# Altium project display.PrjPcb (part 1 of 2)
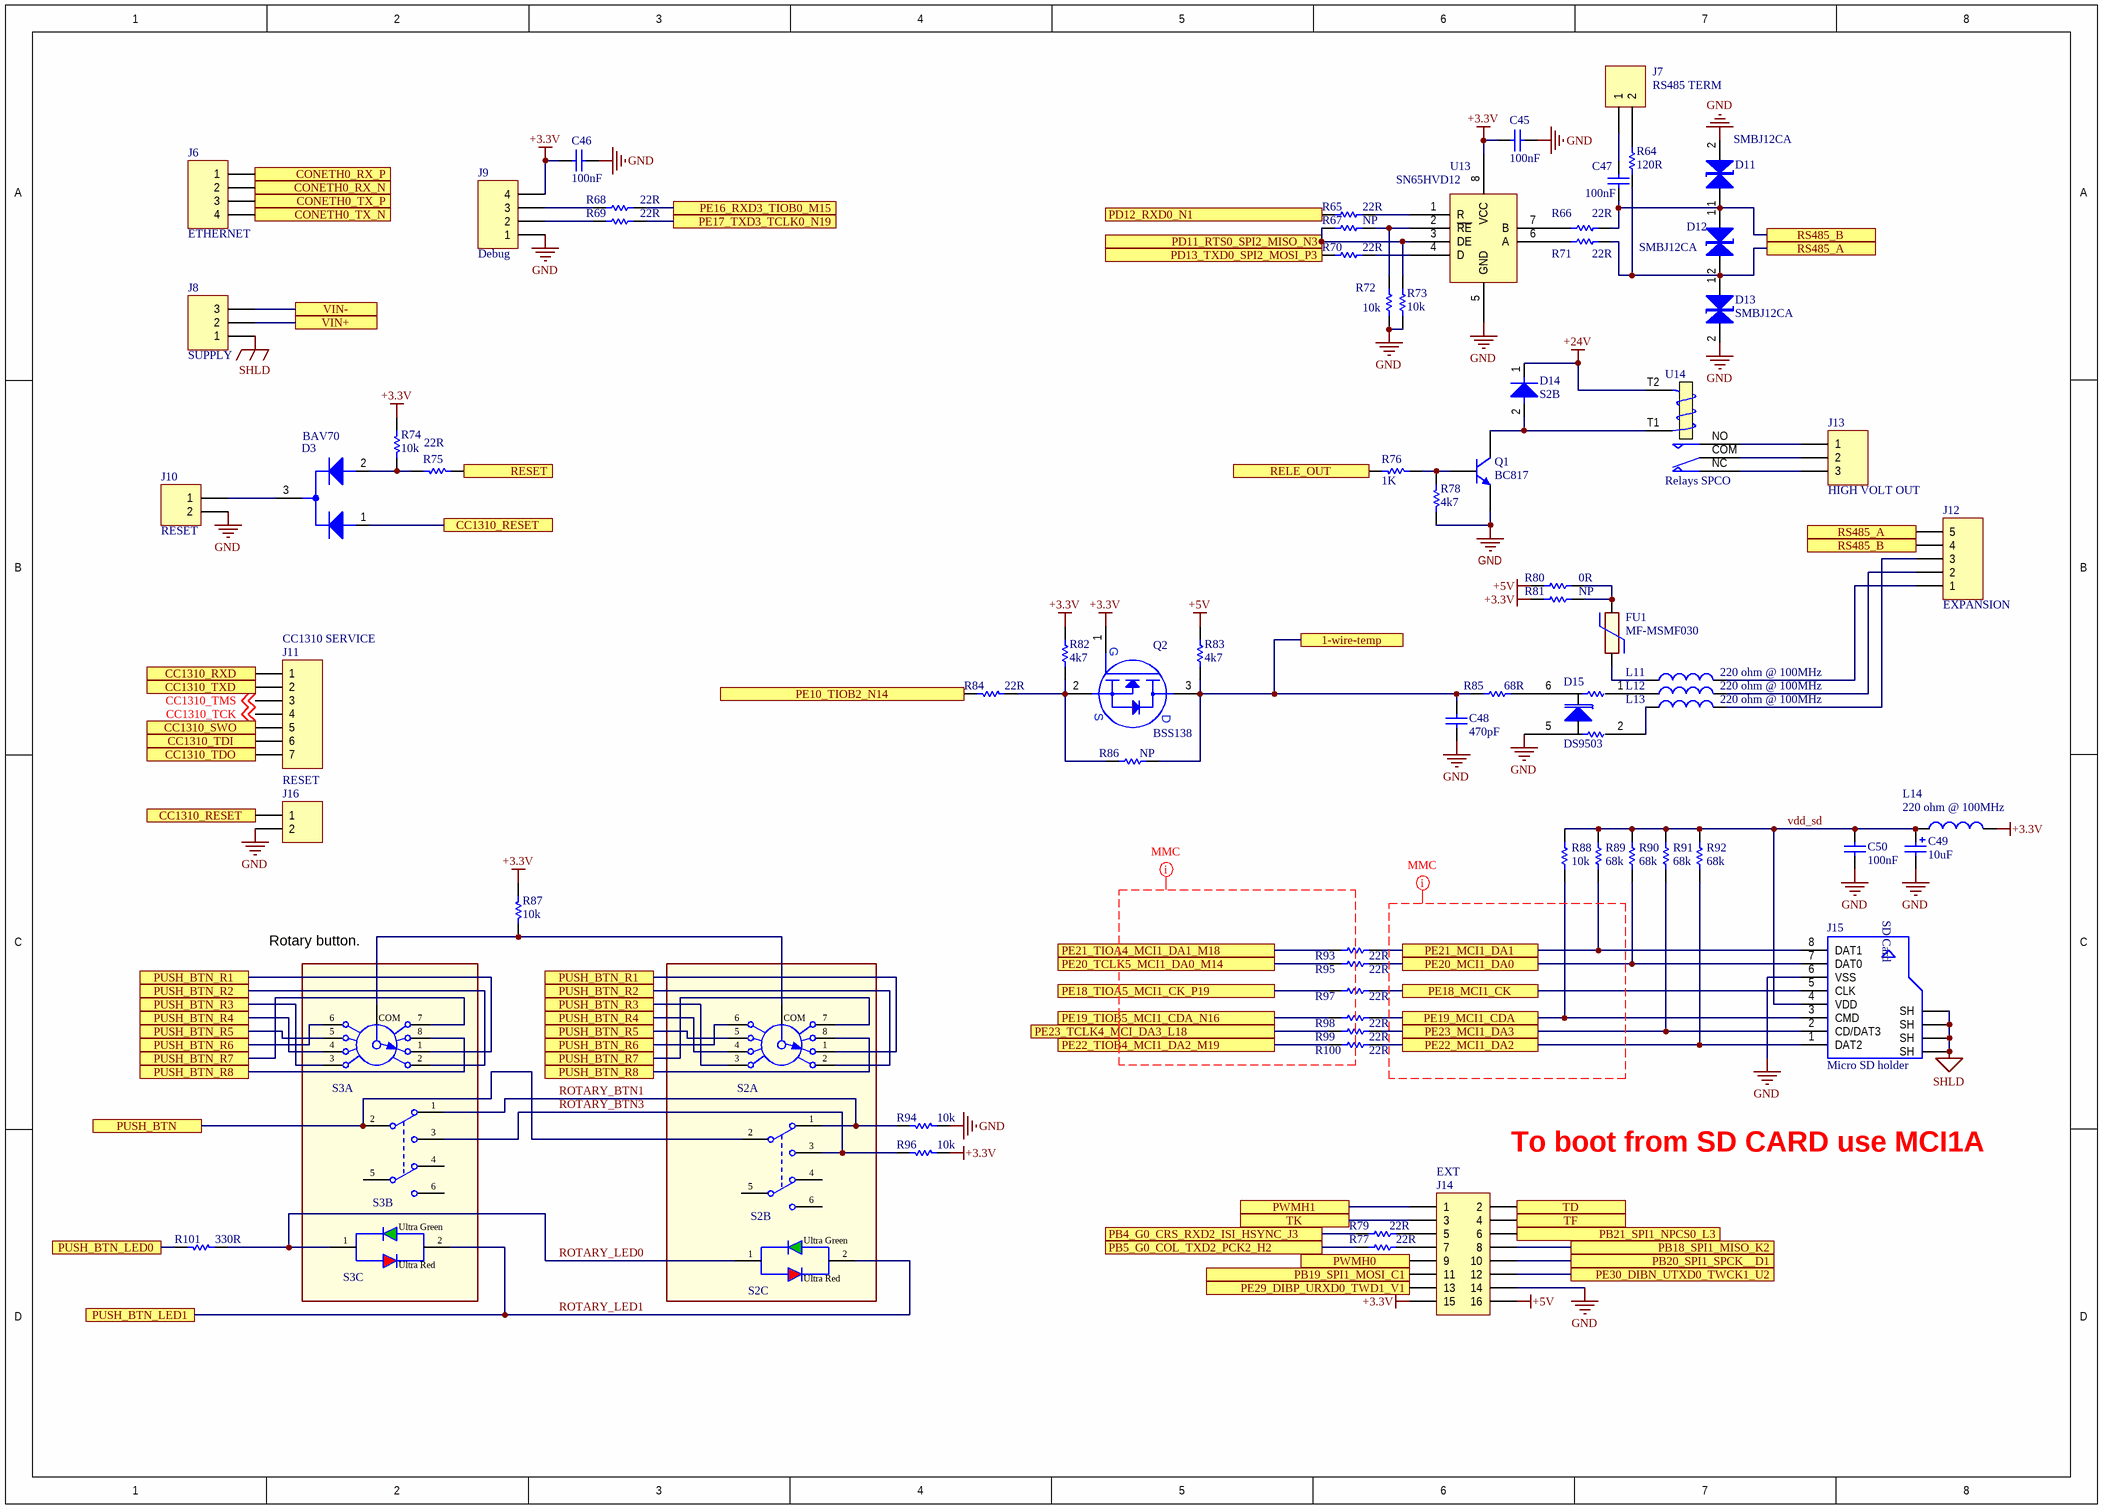
[diagram p0: connector.SchDoc]
8 sheets, 343 parts. Net scope: flat (ports and power ports of the same name join across sheets).
Board file: display.PcbDoc
Sheets:
  connector.SchDoc
  develboard.SchDoc
  display.SchDoc
  supply.SchDoc
  sensor_output.SchDoc
  wifi.schdoc
  ethernet.SchDoc
  sub-1Ghz_radio.SchDoc

## Sheet connector.SchDoc: Connectors
size A3; Hw_rev: 0; License: GPLv3; Address3: Firenze; Address4: ITALY; DocumentNumber: 1; Revision: 0; SheetNumber: 1; SheetTotal: 8

### Parts
C45  100nF  [0603_[1608]]
C46  100nF  [0603_[1608]]
C47  100nF  [0603_[1608]]
C48  470pF  [0603_[1608]]
C49  10uF  [1206_[3216]]
C50  100nF  [0603_[1608]]
D3  BAV70  [SOT-23]
D11  SMBJ12CA  [DO214AA_K1-A2_SMB]
D12  SMBJ12CA  [DO214AA_K1-A2_SMB]
D13  SMBJ12CA  [DO214AA_K1-A2_SMB]
D14  S2B  [DO214AA_K1-A2_SMB]
D15  DS9503  [TSOC6]
FU1  MF-MSMF030  [1812-[4532]]
J6  ETHERNET  [CON_4P_WAGO_2.5MM]
J7  RS485 TERM  [HEADER_1X2_2.54MM_THD]
J8  SUPPLY  [CON_3P_WAGO_3.5mm]
J9  Debug  [HEADER_1X4_2.54MM_THD]
J10  RESET  [HEADER_1X2_2.54MM_THD]
J11  CC1310 SERVICE  [HEADER_1X7_2.54MM_THD]
J12  EXPANSION  [CON_5P_WAGO_2.5MM]
J13  HIGH VOLT OUT  [CON_3P_WAGO_3.5mm]
J14  EXT  [HEADER_2X8_2.54MM_THD]
J15  Micro SD holder  [micro_sd_holder_pp]
J16  RESET  [HEADER_1X2_2.54MM_THD]
L11  220 ohm @ 100MHz  [0805_[2012]]
L12  220 ohm @ 100MHz  [0805_[2012]]
L13  220 ohm @ 100MHz  [0805_[2012]]
L14  220 ohm @ 100MHz  [0805_[2012]]
Q1  BC817  [SOT-23]
Q2  BSS138  [sot-23]
R64  120R  [0603_[1608]]
R65  22R  [0603_[1608]]
R66  22R  [0603_[1608]]
R67  NP  [0603_[1608]]
R68  22R  [0603_[1608]]
R69  22R  [0603_[1608]]
R70  22R  [0603_[1608]]
R71  22R  [0603_[1608]]
R72  10k  [0603_[1608]]
R73  10k  [0603_[1608]]
R74  10k  [0603_[1608]]
R75  22R  [0603_[1608]]
R76  1K  [0603_[1608]]
R77  22R  [0603_[1608]]
R78  4k7  [0603_[1608]]
R79  22R  [0603_[1608]]
R80  0R  [0603_[1608]]
R81  NP  [0603_[1608]]
R82  4k7  [0603_[1608]]
R83  4k7  [0603_[1608]]
R84  22R  [0603_[1608]]
R85  68R  [0603_[1608]]
R86  NP  [0603_[1608]]
R87  10k  [0603_[1608]]
R88  10k  [0603_[1608]]
R89  68k  [0603_[1608]]
R90  68k  [0603_[1608]]
R91  68k  [0603_[1608]]
R92  68k  [0603_[1608]]
R93  22R  [0603_[1608]]
R94  10k  [0603_[1608]]
R95  22R  [0603_[1608]]
R96  10k  [0603_[1608]]
R97  22R  [0603_[1608]]
R98  22R  [0603_[1608]]
R99  22R  [0603_[1608]]
R100  22R  [0603_[1608]]
R101  330R  [0603_[1608]]
S2  481RV12172100  [Rotary-push-button-481RV12172100]  (value not drawn)  (parts A,B,C of 3)
S3  481RV12172100  [Rotary-push-button-481RV12172100]  (value not drawn)  (parts A,B,C of 3)
U13  SN65HVD12  [SOIC8]
U14  Relays SPCO  [RELAYS_SPDT_THD_20x10MM]

### Ports
1-wire-temp, CC1310_RESET, CC1310_RXD, CC1310_SWO, CC1310_TDI, CC1310_TDO, CC1310_TXD, CONETH0_RX_N, CONETH0_RX_P, CONETH0_TX_N, CONETH0_TX_P, PB4_G0_CRS_RXD2_ISI_HSYNC_J3, PB5_G0_COL_TXD2_PCK2_H2, PB18_SPI1_MISO_K2, PB19_SPI1_MOSI_C1, PB20_SPI1_SPCK__D1, PB21_SPI1_NPCS0_L3, PD11_RTS0_SPI2_MISO_N3, PD12_RXD0_N1, PD13_TXD0_SPI2_MOSI_P3, PE10_TIOB2_N14, PE16_RXD3_TIOB0_M15, PE17_TXD3_TCLK0_N19, PE18_MCI1_CK, PE18_TIOA5_MCI1_CK_P19, PE19_MCI1_CDA, PE19_TIOB5_MCI1_CDA_N16, PE20_MCI1_DA0, PE20_TCLK5_MCI1_DA0_M14, PE21_MCI1_DA1, PE21_TIOA4_MCI1_DA1_M18, PE22_MCI1_DA2, PE22_TIOB4_MCI1_DA2_M19, PE23_MCI1_DA3, PE23_TCLK4_MCI_DA3_L18, PE29_DIBP_URXD0_TWD1_V1, PE30_DIBN_UTXD0_TWCK1_U2, PUSH_BTN, PUSH_BTN_LED0, PUSH_BTN_LED1, PUSH_BTN_R1, PUSH_BTN_R2, PUSH_BTN_R3, PUSH_BTN_R4, PUSH_BTN_R5, PUSH_BTN_R6, PUSH_BTN_R7, PUSH_BTN_R8, PWMH0, PWMH1, RELE_OUT, RESET, RS485_A, RS485_B, TD, TF, TK, VIN+, VIN-

### Nets
+3.3V: C45.2 C46.1 J9.4 J14.15 L14.1 Q2.1(G) R74.1 R81.2 R82.2 R87.1 R96.1 U13.8(VCC)
+5V: J14.16 R80.2 R83.2
+24V: D14.1(K) U14.T2
GND: C45.1 C46.2 C48.2 C49.2 C50.2 D11.2 D13.2 D15.5 J9.1 J10.2 J14.14 J15.6(VSS) J16.2 Q1.2(E) R72.1 R73.1 R78.1 R94.1 U13.5(GND)
SHLD: J8.1 J15.Z1(SH) J15.Z2(SH) J15.Z3(SH) J15.Z4(SH)
1-wire-temp: C48.1 Q2.3(D) R83.1 R85.1 R86.2 ; port 1-wire-temp
CC1310_RESET: D3.1 J16.1 ; port CC1310_RESET
CC1310_RXD: J11.1 R77.1 ; port PB5_G0_COL_TXD2_PCK2_H2, port CC1310_RXD
CC1310_SWO: J11.5 ; port CC1310_SWO
CC1310_TCK: J11.4 ; off-sheet CC1310_TCK
CC1310_TDI: J11.6 ; port CC1310_TDI
CC1310_TDO: J11.7 ; port CC1310_TDO
CC1310_TMS: J11.3 ; off-sheet CC1310_TMS
CC1310_TXD: J11.2 R79.1 ; port PB4_G0_CRS_RXD2_ISI_HSYNC_J3, port CC1310_TXD
crx_n: J6.2 ; port CONETH0_RX_N
crx_p: J6.1 ; port CONETH0_RX_P
ctx_n: J6.4 ; port CONETH0_TX_N
ctx_p: J6.3 ; port CONETH0_TX_P
PB15_G0_TX3_SPI2_NPCS2_PWML0_E2: R76.2 ; port RELE_OUT
PB18_SPI1_MISO_K2: J14.8 ; port PB18_SPI1_MISO_K2
PB19_SPI1_MOSI_C1: J14.11 ; port PB19_SPI1_MOSI_C1
PB20_SPI1_SPCK__D1: J14.10 ; port PB20_SPI1_SPCK__D1
PB21_SPI1_NPCS0_L3: J14.6 ; port PB21_SPI1_NPCS0_L3
PC20_ISI_D1_TF1_V11: S2.R4 S3.R4 ; port PUSH_BTN_R4
PC23_ISI_D4_RD1_U16: R101.2 ; port PUSH_BTN_LED0
PC31_AD4_PWMH1_T13: S2.P2 S3.P2 ; port PUSH_BTN
PD11_RTS0_SPI2_MISO_N3: R67.2 R73.2 U13.3(DE) ; port PD11_RTS0_SPI2_MISO_N3
PD12_RXD0_N1: R65.2 ; port PD12_RXD0_N1
PD13_TXD0_SPI2_MOSI_P3: R70.2 ; port PD13_TXD0_SPI2_MOSI_P3
PD19_P11: S2.R8 S3.R8 ; port PUSH_BTN_R8
PD21_P10: S2.R2 S3.R2 ; port PUSH_BTN_R2
PD22_U11: S2.R5 S3.R5 ; port PUSH_BTN_R5
PD23_R10: S2.R1 S3.R1 ; port PUSH_BTN_R1
PD24_U10: S2.R7 S3.R7 ; port PUSH_BTN_R7
PD25_R11: S2.R6 S3.R6 ; port PUSH_BTN_R6
PD31_SPI0_NPCS2_PCK1_P5: S2.R3 S3.R3 ; port PUSH_BTN_R3
PE10_TIOB2_N14: R84.2 ; port PE10_TIOB2_N14
PE16_RXD3_TIOB0_M15: R68.1 ; port PE16_RXD3_TIOB0_M15
PE17_TXD3_TCLK0_N19: R69.1 ; port PE17_TXD3_TCLK0_N19
PE18_MCI1_CK: J15.5(CLK) R97.2 ; port PE18_MCI1_CK
PE18_TIOA5_MCI1_CK_P19: R97.1 ; port PE18_TIOA5_MCI1_CK_P19
PE19_MCI1_CDA: J15.3(CMD) R88.2 R98.2 ; port PE19_MCI1_CDA
PE19_TIOB5_MCI1_CDA_N16: R98.1 ; port PE19_TIOB5_MCI1_CDA_N16
PE20_MCI1_DA0: J15.7(DAT0) R90.2 R95.2 ; port PE20_MCI1_DA0
PE20_TCLK5_MCI1_DA0_M14: R95.1 ; port PE20_TCLK5_MCI1_DA0_M14
PE21_MCI1_DA1: J15.8(DAT1) R89.2 R93.2 ; port PE21_MCI1_DA1
PE21_TIOA4_MCI1_DA1_M18: R93.1 ; port PE21_TIOA4_MCI1_DA1_M18
PE22_MCI1_DA2: J15.1(DAT2) R92.2 R100.2 ; port PE22_MCI1_DA2
PE22_TIOB4_MCI1_DA2_M19: R100.1 ; port PE22_TIOB4_MCI1_DA2_M19
PE23_MCI1_DA3: J15.2(CD/DAT3) R91.2 R99.2 ; port PE23_MCI1_DA3
PE23_TCLK4_MCI_DA3_L18: R99.1 ; port PE23_TCLK4_MCI_DA3_L18
PE29_DIBP_URXD0_TWD1_V1: J14.13 ; port PE29_DIBP_URXD0_TWD1_V1
PE30_DIBN_UTXD0_TWCK1_U2: J14.12 ; port PE30_DIBN_UTXD0_TWCK1_U2
PWMH0: J14.9 ; port PWMH0
PWMH1: J14.1 ; port PWMH1
RESET: R75.2 ; port RESET
ROTARY_BTN1: R94.2 S2.P1 S3.P1
ROTARY_BTN3: R96.2 S2.P3 S3.P3
ROTARY_LED0: R101.1 S2.L1 S3.L1
ROTARY_LED1: S2.L2 S3.L2 ; port PUSH_BTN_LED1
RS485_A: D12.2 D13.1 J12.5 R64.2 R71.2 ; port RS485_A
RS485_B: C47.2 D11.1 D12.1 J12.4 R66.2 ; port RS485_B
TD: J14.2 ; port TD
TF: J14.4 ; port TF
TK: J14.3 ; port TK
vdd_sd: C49.1 C50.1 J15.4(VDD) L14.2 R88.1 R89.1 R90.1 R91.1 R92.1
VIN+: J8.2 ; port VIN+
VIN-: J8.3 ; port VIN-
NetC47_1: C47.1 J7.1
NetD3_2: D3.2 R74.2 R75.1
NetD3_3: D3.3 J10.1
NetD14_2: D14.2(A) Q1.3(C) U14.T1
NetD15_1: D15.1 L12.1
NetD15_2: D15.2 L13.1
NetD15_6: D15.6 R85.2
NetFU1_1: FU1.1 R80.1 R81.1
NetFU1_2: FU1.2 L11.1
NetJ7_2: J7.2 R64.1
NetJ9_2: J9.2 R69.2
NetJ9_3: J9.3 R68.2
NetJ12_1: J12.1 L11.2
NetJ12_2: J12.2 L12.2
NetJ12_3: J12.3 L13.2
NetJ13_1: J13.1 U14.NO
NetJ13_2: J13.2 U14.COM
NetJ13_3: J13.3 U14.NC
NetJ14_5: J14.5 R79.2
NetJ14_7: J14.7 R77.2
NetQ1_1: Q1.1(B) R76.1 R78.2
NetQ2_2: Q2.2(S) R82.1 R84.1 R86.1
NetR65_1: R65.1 U13.1(R)
NetR66_1: R66.1 U13.7(B)
NetR67_1: R67.1 R72.2 U13.2(~{RE})
NetR70_1: R70.1 U13.4(D)
NetR71_1: R71.1 U13.6(A)
NetR87_2: R87.2 S2.C S3.C

Not connected (* = marked no-connect by the designer): S2 P4 P5 P6; S3 P4 P5 P6

### Layout directives
net class mmc: (no net found under the mark)
net class mmc_con: (no net found under the mark)

### Notes on the sheet
- Rotary button.
- To boot from SD CARD use MCI1A
- (in symbol micro_sd_holde) SD Card
- (in symbol Rotary-push-button-481RV12172100, part A) 6; COM; 7; 5; 8; 4; 1; 3; 2
- (in symbol Rotary-push-button-481RV12172100, part B) 1; 2; 3; 4; 5; 6
- (in symbol Rotary-push-button-481RV12172100, part C) Ultra Green; 1; 2; Ultra Red

### Library data of the parts
C45 C47 C48 C50 = Cap: Ceramic X7R 50V; Value: 100pF; Published: 8-Jun-2000; LatestRevisionDate: 17-Jul-2002; LatestRevisionNote: Re-released for DXP Platform.; PackageReference: RAD-0.3; Publisher: Altium Limited; PackageDescription: Radial Cap, Thru-Hole; 2 Leads; 0.3 in Pin Spacing
C46 = Cap: Ceramic X7R 50V; Value: 10nF; Published: 8-Jun-2000; Revision: July-2002: Re-released for DXP Platform.; Publisher: Altium Limited
C49 = Cap Pol1: Ceramic X5R 25V; Published: 8-Jun-2000; Revision: July-2002: Re-released for DXP Platform.; Publisher: Altium Limited; Value: 10uF
D3 = BAV70: SOT23
D11-D13 = TVS bi: TVS bidirectional
D14 = Diode: S2B Diode
D15 = DS9503: ESD Protection Diode with Resistors; Mouser: 700-DS9503P+T&R; Farnell: 2516827
FU1 = FuseAutoReset: Fuse autoreset; Farnell: 1652168; Mouser: 652-MF-MSMF030-2
J6 = Header 4: Header, 4-Pin; LatestRevisionDate: 17-Jul-2002; LatestRevisionNote: Re-released for DXP Platform.; Publisher: Altium Limited
J7 = Header 2: Pin Header, 2.54mm, 1x2, 2pin; LatestRevisionDate: 17-Jul-2002; LatestRevisionNote: Re-released for DXP Platform.; Publisher: Altium Limited
J8 J13 = Header 3: Terminal Block, 3.5mm, 3p, screew less; LatestRevisionDate: 17-Jul-2002; LatestRevisionNote: Re-released for DXP Platform.; Publisher: Altium Limited
J9 = Header 4: Pin Header, 4pin, 4x1, 2.54mm, THD; LatestRevisionDate: 17-Jul-2002; LatestRevisionNote: Re-released for DXP Platform.; Publisher: Altium Limited
J10 J16 = Header 2: Pin Header, 2pin, 1x2, 2.54mm, THD; LatestRevisionDate: 17-Jul-2002; LatestRevisionNote: Re-released for DXP Platform.; Publisher: Altium Limited
J11 = Header 7: Header, 7-Pin; LatestRevisionDate: 17-Jul-2002; LatestRevisionNote: Re-released for DXP Platform.; Publisher: Altium Limited
J12 = Header 5: Terminal Block, 2.5mm, 5p (Wago 250-405); LatestRevisionDate: 17-Jul-2002; LatestRevisionNote: Re-released for DXP Platform.; Publisher: Altium Limited
J14 = Header 8X2: Header, 8-Pin, Dual row; LatestRevisionDate: 17-Jul-2002; LatestRevisionNote: Re-released for DXP Platform.; Publisher: Altium Limited
J15 = micro_sd_holde: WR-CRD Micro SD_Push and Push (693071010811); Manufacturer: Würth Elektronik eiSos GmbH; ComponentLink1 Description: Manufacturer; ComponentLink2 Description: Datasheet; NoPins: 8; ComponentLink1URL: http://www.we-online.de; ComponentLink2URL: http://katalog.we-online.de/em/datasheet/693071010811.pdf; Created by: Karrer Zheng; Created Date: 10/10/2014; partNo: 693071010811
L11-L13 = Inductor: WE 742792022; Code_IEC: 1005; Value: 10mH; Published: 8-Jun-2000; LatestRevisionDate: 29-May-2009; LatestRevisionNote: IPC-7351 Footprint Added.; PackageReference: 0402-A; Publisher: Altium Limited; PackageDescription: Chip Inductor; Code_JEITA: 0402
L14 = Inductor: WE 742792022
Q1 = BC817: NPN General-purpose Transistor; Published: 17-Sep-2003; LatestRevisionDate: 12-Dec-2006; LatestRevisionNote: IPC-7351 Footprint Added.; DatasheetVersion: Jun-1999; PackageVersion: May-1999; PackageReference: SOT23; Publisher: Altium Limited; PackageDescription: 3-Pin SOT-23 Package 0.95 mm Pitch, 2.3 mm Lead Span; ComponentLink1Description: Manufacturer Link; ComponentLink1URL: http://www.semiconductors.philips.com/; ComponentLink2Description: Datasheet; ComponentLink2URL: http://www.semiconductors.philips.com/acrobat/datasheets/BC817_BC817W_BC337_5.pdf
Q2 = MOSFET-N 3pin: N MOS
R64 R66 R67 R71-R73 R76-R79 R82-R87 R94 R96 R101 = Res1: Resistor; Revision: July-2002: Re-released for DXP Platform.
R65 R68-R70 R74 R75 R80 R81 R88-R93 R95 R97-R100 = Res1: Resistor; Value: 1K; Published: 8-Jun-2000; Revision: July-2002: Re-released for DXP Platform.; Publisher: Altium Limited
S2 S3 = Rotary-push-button-481RV12172100: WS-RPTL 20x20 mm illuminated THT Rotary Push button Switch; Emitting Color: Red & Bright green; ComponentLink1Description: Manufacturer; ComponentLink1URL: http://www.we-online.de; ComponentLink2Description: Datasheet; ComponentLink2URL: http://katalog.we-online.de/em/datasheet/481RV12172100.pdf; Part Number: 481RV12172100; Published Date: June 2017; Publisher: Wurth Elektronik
U13 = SN65HVD12: 3.3V to RS485 interface
U14 = Relay SPCO: Relays SPCO, Coil 12V, 250Vac (Omron G5SB); Farnell: 2213814

## Sheet develboard.SchDoc
size A3; License: GPLv3; Hw_rev: 0; Address3: Firenze; Address4: ITALY; DocumentNumber: 3; Revision: 0; SheetNumber: 3; SheetTotal: 8
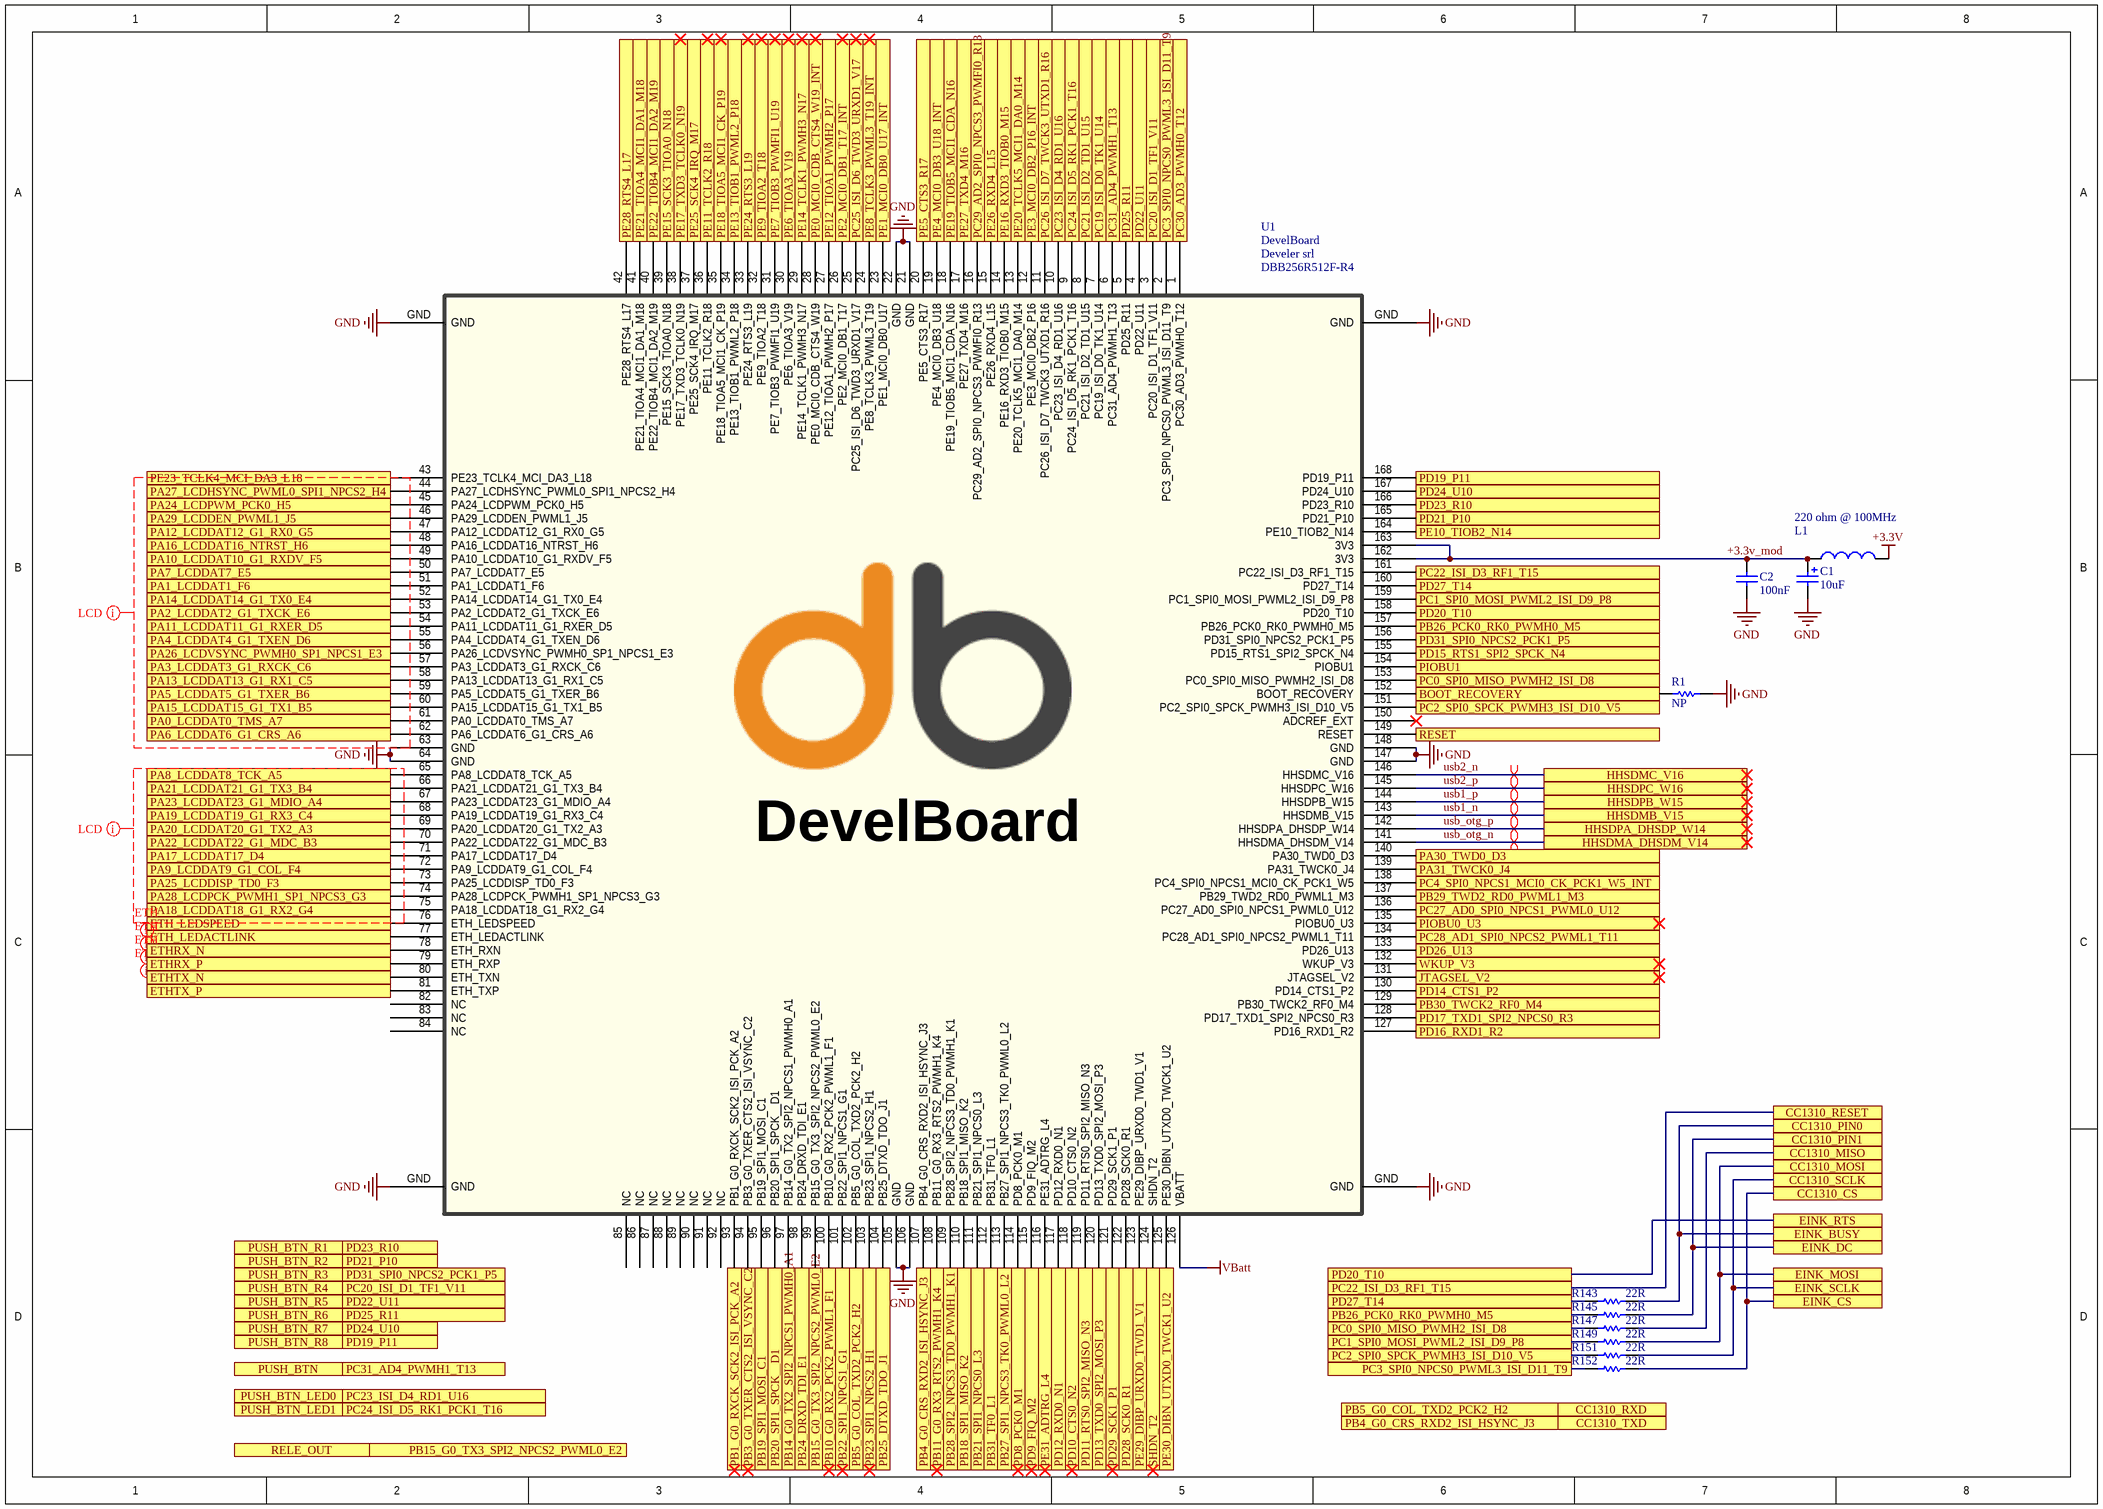
[diagram p1: develboard.SchDoc]

### Parts
C1  10uF  [1206_[3216]]
C2  100nF  [0603_[1608]]
L1  220 ohm @ 100MHz  [0805_[2012]]
R1  NP  [0603_[1608]]
R143  22R  [0603_[1608]]
R145  22R  [0603_[1608]]
R147  22R  [0603_[1608]]
R149  22R  [0603_[1608]]
R151  22R  [0603_[1608]]
R152  22R  [0603_[1608]]
U1  DevelBoard  Company: Develer srl  Order Code: DBB256R512F-R4  [develboard_footprint]

### Ports
BOOT_RECOVERY, CC1310_CS, CC1310_MISO, CC1310_MOSI, CC1310_PIN0, CC1310_PIN1, CC1310_RESET, CC1310_RXD, CC1310_SCLK, CC1310_TXD, EINK_BUSY, EINK_CS, EINK_DC, EINK_MOSI, EINK_RTS, EINK_SCLK, ETH_LEDACTLINK, ETH_LEDSPEED, ETHRX_N, ETHRX_P, ETHTX_N, ETHTX_P, HHSDMA_DHSDM_V14, HHSDMB_V15, HHSDMC_V16, HHSDPA_DHSDP_W14, HHSDPB_W15, HHSDPC_W16, JTAGSEL_V2, PA0_LCDDAT0_TMS_A7, PA1_LCDDAT1_F6, PA2_LCDDAT2_G1_TXCK_E6, PA3_LCDDAT3_G1_RXCK_C6, PA4_LCDDAT4_G1_TXEN_D6, PA5_LCDDAT5_G1_TXER_B6, PA6_LCDDAT6_G1_CRS_A6, PA7_LCDDAT7_E5, PA8_LCDDAT8_TCK_A5, PA9_LCDDAT9_G1_COL_F4, PA10_LCDDAT10_G1_RXDV_F5, PA11_LCDDAT11_G1_RXER_D5, PA12_LCDDAT12_G1_RX0_G5, PA13_LCDDAT13_G1_RX1_C5, PA14_LCDDAT14_G1_TX0_E4, PA15_LCDDAT15_G1_TX1_B5, PA16_LCDDAT16_NTRST_H6, PA17_LCDDAT17_D4, PA18_LCDDAT18_G1_RX2_G4, PA19_LCDDAT19_G1_RX3_C4, PA20_LCDDAT20_G1_TX2_A3, PA21_LCDDAT21_G1_TX3_B4, PA22_LCDDAT22_G1_MDC_B3, PA23_LCDDAT23_G1_MDIO_A4, PA24_LCDPWM_PCK0_H5, PA25_LCDDISP_TD0_F3, PA26_LCDVSYNC_PWMH0_SP1_NPCS1_E3, PA27_LCDHSYNC_PWML0_SPI1_NPCS2_H4, PA28_LCDPCK_PWMH1_SP1_NPCS3_G3, PA29_LCDDEN_PWML1_J5, PA30_TWD0_D3, PA31_TWCK0_J4, PB1_G0_RXCK_SCK2_ISI_PCK_A2, PB3_G0_TXER_CTS2_ISI_VSYNC_C2, PB4_G0_CRS_RXD2_ISI_HSYNC_J3, PB5_G0_COL_TXD2_PCK2_H2, PB10_G0_RX2_PCK2_PWML1_F1, PB11_G0_RX3_RTS2_PWMH1_K4, PB14_G0_TX2_SPI2_NPCS1_PWMH0_A1, PB15_G0_TX3_SPI2_NPCS2_PWML0_E2, PB18_SPI1_MISO_K2, PB19_SPI1_MOSI_C1, PB20_SPI1_SPCK__D1, PB21_SPI1_NPCS0_L3, PB22_SPI1_NPCS1_G1, PB23_SPI1_NPCS2_H1, PB24_DRXD_TDI_E1, PB25_DTXD_TDO_J1, PB26_PCK0_RK0_PWMH0_M5, PB27_SPI1_NPCS3_TK0_PWML0_L2, PB28_SPI2_NPCS3_TD0_PWMH1_K1, PB29_TWD2_RD0_PWML1_M3, PB30_TWCK2_RF0_M4, PB31_TF0_L1, PC0_SPI0_MISO_PWMH2_ISI_D8, PC1_SPI0_MOSI_PWML2_ISI_D9_P8, PC2_SPI0_SPCK_PWMH3_ISI_D10_V5, PC3_SPI0_NPCS0_PWML3_ISI_D11_T9, PC4_SPI0_NPCS1_MCI0_CK_PCK1_W5_INT, PC19_ISI_D0_TK1_U14, PC20_ISI_D1_TF1_V11, PC21_ISI_D2_TD1_U15, PC22_ISI_D3_RF1_T15, PC23_ISI_D4_RD1_U16, PC24_ISI_D5_RK1_PCK1_T16, PC25_ISI_D6_TWD3_URXD1_V17, PC26_ISI_D7_TWCK3_UTXD1_R16, PC27_AD0_SPI0_NPCS1_PWML0_U12, PC28_AD1_SPI0_NPCS2_PWML1_T11, PC29_AD2_SPI0_NPCS3_PWMFI0_R13, PC30_AD3_PWMH0_T12, PC31_AD4_PWMH1_T13, PD8_PCK0_M1, PD9_FIQ_M2, PD10_CTS0_N2, PD11_RTS0_SPI2_MISO_N3, PD12_RXD0_N1, PD13_TXD0_SPI2_MOSI_P3, PD14_CTS1_P2, PD15_RTS1_SPI2_SPCK_N4, PD16_RXD1_R2, PD17_TXD1_SPI2_NPCS0_R3, PD19_P11, PD20_T10, PD21_P10, PD22_U11, PD23_R10, PD24_U10, PD25_R11, PD26_U13, PD27_T14, PD28_SCK0_R1, PD29_SCK1_P1, PD31_SPI0_NPCS2_PCK1_P5, PE0_MCI0_CDB_CTS4_W19_INT, PE1_MCI0_DB0_U17_INT, PE2_MCI0_DB1_T17_INT, PE3_MCI0_DB2_P16_INT, PE4_MCI0_DB3_U18_INT, PE5_CTS3_R17, PE6_TIOA3_V19, PE7_TIOB3_PWMFI1_U19, PE8_TCLK3_PWML3_T19_INT, PE9_TIOA2_T18, PE10_TIOB2_N14, PE11_TCLK2_R18, PE12_TIOA1_PWMH2_P17, PE13_TIOB1_PWML2_P18, PE14_TCLK1_PWMH3_N17, PE15_SCK3_TIOA0_N18, PE16_RXD3_TIOB0_M15, PE17_TXD3_TCLK0_N19, PE18_TIOA5_MCI1_CK_P19, PE19_TIOB5_MCI1_CDA_N16, PE20_TCLK5_MCI1_DA0_M14, PE21_TIOA4_MCI1_DA1_M18, PE22_TIOB4_MCI1_DA2_M19, PE23_TCLK4_MCI_DA3_L18, PE24_RTS3_L19, PE25_SCK4_IRQ_M17, PE26_RXD4_L15, PE27_TXD4_M16, PE28_RTS4_L17, PE29_DIBP_URXD0_TWD1_V1, PE30_DIBN_UTXD0_TWCK1_U2, PE31_ADTRG_L4, PIOBU0_U3, PIOBU1, PUSH_BTN, PUSH_BTN_LED0, PUSH_BTN_LED1, PUSH_BTN_R1, PUSH_BTN_R2, PUSH_BTN_R3, PUSH_BTN_R4, PUSH_BTN_R5, PUSH_BTN_R6, PUSH_BTN_R7, PUSH_BTN_R8, RELE_OUT, RESET, SHDN_T2, WKUP_V3

### Nets
+3.3V: L1.1
GND: C1.2 C2.2 R1.1 U1.21(GND) U1.22(GND) U1.63(GND) U1.64(GND) U1.105(GND) U1.106(GND) U1.147(GND) U1.148(GND) U1.GND
VBatt: U1.126(VBATT)
+3.3v_mod: C1.1 C2.1 L1.2 U1.162(3V3) U1.163(3V3)
BOOT_RECOVERY: R1.2 U1.152(BOOT_RECOVERY) ; port BOOT_RECOVERY
CC1310_CS: R152.1 ; port CC1310_CS, port EINK_CS
CC1310_MISO: R147.1 ; port CC1310_MISO
CC1310_MOSI: R149.1 ; port CC1310_MOSI, port EINK_MOSI
CC1310_PIN0: R143.1 ; port CC1310_PIN0, port EINK_BUSY
CC1310_PIN1: R145.1 ; port CC1310_PIN1, port EINK_DC
CC1310_RESET: U1.161(PC22_ISI_D3_RF1_T15) ; port PC22_ISI_D3_RF1_T15, port CC1310_RESET
CC1310_RXD: U1.102(PB5_G0_COL_TXD2_PCK2_H2) ; port PB5_G0_COL_TXD2_PCK2_H2, port CC1310_RXD
CC1310_SCLK: R151.1 ; port CC1310_SCLK, port EINK_SCLK
CC1310_TXD: U1.107(PB4_G0_CRS_RXD2_ISI_HSYNC_J3) ; port PB4_G0_CRS_RXD2_ISI_HSYNC_J3, port CC1310_TXD
EINK_RTS: U1.158(PD20_T10) ; port PD20_T10, port EINK_RTS
ETH_LEDACTLINK: U1.77(ETH_LEDACTLINK) ; port ETH_LEDACTLINK
ETH_LEDSPEED: U1.76(ETH_LEDSPEED) ; port ETH_LEDSPEED
JTAGSEL_V2: U1.131(JTAGSEL_V2) ; port JTAGSEL_V2
PA0_LCDDAT0_TMS_A7: U1.61(PA0_LCDDAT0_TMS_A7) ; port PA0_LCDDAT0_TMS_A7
PA1_LCDDAT1_F6: U1.51(PA1_LCDDAT1_F6) ; port PA1_LCDDAT1_F6
PA2_LCDDAT2_G1_TXCK_E6: U1.53(PA2_LCDDAT2_G1_TXCK_E6) ; port PA2_LCDDAT2_G1_TXCK_E6
PA3_LCDDAT3_G1_RXCK_C6: U1.57(PA3_LCDDAT3_G1_RXCK_C6) ; port PA3_LCDDAT3_G1_RXCK_C6
PA4_LCDDAT4_G1_TXEN_D6: U1.55(PA4_LCDDAT4_G1_TXEN_D6) ; port PA4_LCDDAT4_G1_TXEN_D6
PA5_LCDDAT5_G1_TXER_B6: U1.59(PA5_LCDDAT5_G1_TXER_B6) ; port PA5_LCDDAT5_G1_TXER_B6
PA6_LCDDAT6_G1_CRS_A6: U1.62(PA6_LCDDAT6_G1_CRS_A6) ; port PA6_LCDDAT6_G1_CRS_A6
PA7_LCDDAT7_E5: U1.50(PA7_LCDDAT7_E5) ; port PA7_LCDDAT7_E5
PA8_LCDDAT8_TCK_A5: U1.65(PA8_LCDDAT8_TCK_A5) ; port PA8_LCDDAT8_TCK_A5
PA9_LCDDAT9_G1_COL_F4: U1.72(PA9_LCDDAT9_G1_COL_F4) ; port PA9_LCDDAT9_G1_COL_F4
PA10_LCDDAT10_G1_RXDV_F5: U1.49(PA10_LCDDAT10_G1_RXDV_F5) ; port PA10_LCDDAT10_G1_RXDV_F5
PA11_LCDDAT11_G1_RXER_D5: U1.54(PA11_LCDDAT11_G1_RXER_D5) ; port PA11_LCDDAT11_G1_RXER_D5
PA12_LCDDAT12_G1_RX0_G5: U1.47(PA12_LCDDAT12_G1_RX0_G5) ; port PA12_LCDDAT12_G1_RX0_G5
PA13_LCDDAT13_G1_RX1_C5: U1.58(PA13_LCDDAT13_G1_RX1_C5) ; port PA13_LCDDAT13_G1_RX1_C5
PA14_LCDDAT14_G1_TX0_E4: U1.52(PA14_LCDDAT14_G1_TX0_E4) ; port PA14_LCDDAT14_G1_TX0_E4
PA15_LCDDAT15_G1_TX1_B5: U1.60(PA15_LCDDAT15_G1_TX1_B5) ; port PA15_LCDDAT15_G1_TX1_B5
PA16_LCDDAT16_NTRST_H6: U1.48(PA16_LCDDAT16_NTRST_H6) ; port PA16_LCDDAT16_NTRST_H6
PA17_LCDDAT17_D4: U1.71(PA17_LCDDAT17_D4) ; port PA17_LCDDAT17_D4
PA18_LCDDAT18_G1_RX2_G4: U1.75(PA18_LCDDAT18_G1_RX2_G4) ; port PA18_LCDDAT18_G1_RX2_G4
PA19_LCDDAT19_G1_RX3_C4: U1.68(PA19_LCDDAT19_G1_RX3_C4) ; port PA19_LCDDAT19_G1_RX3_C4
PA20_LCDDAT20_G1_TX2_A3: U1.69(PA20_LCDDAT20_G1_TX2_A3) ; port PA20_LCDDAT20_G1_TX2_A3
PA21_LCDDAT21_G1_TX3_B4: U1.66(PA21_LCDDAT21_G1_TX3_B4) ; port PA21_LCDDAT21_G1_TX3_B4
PA22_LCDDAT22_G1_MDC_B3: U1.70(PA22_LCDDAT22_G1_MDC_B3) ; port PA22_LCDDAT22_G1_MDC_B3
PA23_LCDDAT23_G1_MDIO_A4: U1.67(PA23_LCDDAT23_G1_MDIO_A4) ; port PA23_LCDDAT23_G1_MDIO_A4
PA24_LCDPWM_PCK0_H5: U1.45(PA24_LCDPWM_PCK0_H5) ; port PA24_LCDPWM_PCK0_H5
PA25_LCDDISP_TD0_F3: U1.73(PA25_LCDDISP_TD0_F3) ; port PA25_LCDDISP_TD0_F3
PA26_LCDVSYNC_PWMH0_SP1_NPCS1_E3: U1.56(PA26_LCDVSYNC_PWMH0_SP1_NPCS1_E3) ; port PA26_LCDVSYNC_PWMH0_SP1_NPCS1_E3
PA27_LCDHSYNC_PWML0_SPI1_NPCS2_H4: U1.44(PA27_LCDHSYNC_PWML0_SPI1_NPCS2_H4) ; port PA27_LCDHSYNC_PWML0_SPI1_NPCS2_H4
PA28_LCDPCK_PWMH1_SP1_NPCS3_G3: U1.74(PA28_LCDPCK_PWMH1_SP1_NPCS3_G3) ; port PA28_LCDPCK_PWMH1_SP1_NPCS3_G3
PA29_LCDDEN_PWML1_J5: U1.46(PA29_LCDDEN_PWML1_J5) ; port PA29_LCDDEN_PWML1_J5
PA30_TWD0_D3: U1.140(PA30_TWD0_D3) ; port PA30_TWD0_D3
PA31_TWCK0_J4: U1.139(PA31_TWCK0_J4) ; port PA31_TWCK0_J4
PB1_G0_RXCK_SCK2_ISI_PCK_A2: U1.93(PB1_G0_RXCK_SCK2_ISI_PCK_A2) ; port PB1_G0_RXCK_SCK2_ISI_PCK_A2
PB3_G0_TXER_CTS2_ISI_VSYNC_C2: U1.94(PB3_G0_TXER_CTS2_ISI_VSYNC_C2) ; port PB3_G0_TXER_CTS2_ISI_VSYNC_C2
PB10_G0_RX2_PCK2_PWML1_F1: U1.100(PB10_G0_RX2_PCK2_PWML1_F1) ; port PB10_G0_RX2_PCK2_PWML1_F1
PB11_G0_RX3_RTS2_PWMH1_K4: U1.108(PB11_G0_RX3_RTS2_PWMH1_K4) ; port PB11_G0_RX3_RTS2_PWMH1_K4
PB14_G0_TX2_SPI2_NPCS1_PWMH0_A1: U1.97(PB14_G0_TX2_SPI2_NPCS1_PWMH0_A1) ; port PB14_G0_TX2_SPI2_NPCS1_PWMH0_A1
PB15_G0_TX3_SPI2_NPCS2_PWML0_E2: U1.99(PB15_G0_TX3_SPI2_NPCS2_PWML0_E2) ; port PB15_G0_TX3_SPI2_NPCS2_PWML0_E2, port RELE_OUT
PB18_SPI1_MISO_K2: U1.110(PB18_SPI1_MISO_K2) ; port PB18_SPI1_MISO_K2
PB19_SPI1_MOSI_C1: U1.95(PB19_SPI1_MOSI_C1) ; port PB19_SPI1_MOSI_C1
PB20_SPI1_SPCK__D1: U1.96(PB20_SPI1_SPCK__D1) ; port PB20_SPI1_SPCK__D1
PB21_SPI1_NPCS0_L3: U1.111(PB21_SPI1_NPCS0_L3) ; port PB21_SPI1_NPCS0_L3
PB22_SPI1_NPCS1_G1: U1.101(PB22_SPI1_NPCS1_G1) ; port PB22_SPI1_NPCS1_G1
PB23_SPI1_NPCS2_H1: U1.103(PB23_SPI1_NPCS2_H1) ; port PB23_SPI1_NPCS2_H1
PB24_DRXD_TDI_E1: U1.98(PB24_DRXD_TDI_E1) ; port PB24_DRXD_TDI_E1
PB25_DTXD_TDO_J1: U1.104(PB25_DTXD_TDO_J1) ; port PB25_DTXD_TDO_J1
PB26_PCK0_RK0_PWMH0_M5: R145.2 U1.157(PB26_PCK0_RK0_PWMH0_M5) ; port PB26_PCK0_RK0_PWMH0_M5
PB27_SPI1_NPCS3_TK0_PWML0_L2: U1.113(PB27_SPI1_NPCS3_TK0_PWML0_L2) ; port PB27_SPI1_NPCS3_TK0_PWML0_L2
PB28_SPI2_NPCS3_TD0_PWMH1_K1: U1.109(PB28_SPI2_NPCS3_TD0_PWMH1_K1) ; port PB28_SPI2_NPCS3_TD0_PWMH1_K1
PB29_TWD2_RD0_PWML1_M3: U1.137(PB29_TWD2_RD0_PWML1_M3) ; port PB29_TWD2_RD0_PWML1_M3
PB30_TWCK2_RF0_M4: U1.129(PB30_TWCK2_RF0_M4) ; port PB30_TWCK2_RF0_M4
PB31_TF0_L1: U1.112(PB31_TF0_L1) ; port PB31_TF0_L1
PC0_SPI0_MISO_PWMH2_ISI_D8: R147.2 U1.153(PC0_SPI0_MISO_PWMH2_ISI_D8) ; port PC0_SPI0_MISO_PWMH2_ISI_D8
PC1_SPI0_MOSI_PWML2_ISI_D9_P8: R149.2 U1.159(PC1_SPI0_MOSI_PWML2_ISI_D9_P8) ; port PC1_SPI0_MOSI_PWML2_ISI_D9_P8
PC2_SPI0_SPCK_PWMH3_ISI_D10_V5: R151.2 U1.151(PC2_SPI0_SPCK_PWMH3_ISI_D10_V5) ; port PC2_SPI0_SPCK_PWMH3_ISI_D10_V5
PC3_SPI0_NPCS0_PWML3_ISI_D11_T9: R152.2 U1.2(PC3_SPI0_NPCS0_PWML3_ISI_D11_T9) ; port PC3_SPI0_NPCS0_PWML3_ISI_D11_T9
PC4_SPI0_NPCS1_MCI0_CK_PCK1_W5_INT: U1.138(PC4_SPI0_NPCS1_MCI0_CK_PCK1_W5) ; port PC4_SPI0_NPCS1_MCI0_CK_PCK1_W5_INT
PC19_ISI_D0_TK1_U14: U1.7(PC19_ISI_D0_TK1_U14) ; port PC19_ISI_D0_TK1_U14
PC20_ISI_D1_TF1_V11: U1.3(PC20_ISI_D1_TF1_V11) ; port PC20_ISI_D1_TF1_V11, port PUSH_BTN_R4
PC21_ISI_D2_TD1_U15: U1.8(PC21_ISI_D2_TD1_U15) ; port PC21_ISI_D2_TD1_U15
PC23_ISI_D4_RD1_U16: U1.10(PC23_ISI_D4_RD1_U16) ; port PC23_ISI_D4_RD1_U16, port PUSH_BTN_LED0
PC25_ISI_D6_TWD3_URXD1_V17: U1.25(PC25_ISI_D6_TWD3_URXD1_V17) ; port PC25_ISI_D6_TWD3_URXD1_V17
PC26_ISI_D7_TWCK3_UTXD1_R16: U1.11(PC26_ISI_D7_TWCK3_UTXD1_R16) ; port PC26_ISI_D7_TWCK3_UTXD1_R16
PC27_AD0_SPI0_NPCS1_PWML0_U12: U1.136(PC27_AD0_SPI0_NPCS1_PWML0_U12) ; port PC27_AD0_SPI0_NPCS1_PWML0_U12
PC28_AD1_SPI0_NPCS2_PWML1_T11: U1.134(PC28_AD1_SPI0_NPCS2_PWML1_T11) ; port PC28_AD1_SPI0_NPCS2_PWML1_T11
PC29_AD2_SPI0_NPCS3_PWMFI0_R13: U1.16(PC29_AD2_SPI0_NPCS3_PWMFI0_R13) ; port PC29_AD2_SPI0_NPCS3_PWMFI0_R13
PC30_AD3_PWMH0_T12: U1.1(PC30_AD3_PWMH0_T12) ; port PC30_AD3_PWMH0_T12
PC31_AD4_PWMH1_T13: U1.6(PC31_AD4_PWMH1_T13) ; port PC31_AD4_PWMH1_T13, port PUSH_BTN
PD8_PCK0_M1: U1.114(PD8_PCK0_M1) ; port PD8_PCK0_M1
PD9_FIQ_M2: U1.115(PD9_FIQ_M2) ; port PD9_FIQ_M2
PD10_CTS0_N2: U1.118(PD10_CTS0_N2) ; port PD10_CTS0_N2
PD11_RTS0_SPI2_MISO_N3: U1.119(PD11_RTS0_SPI2_MISO_N3) ; port PD11_RTS0_SPI2_MISO_N3
PD12_RXD0_N1: U1.117(PD12_RXD0_N1) ; port PD12_RXD0_N1
PD13_TXD0_SPI2_MOSI_P3: U1.120(PD13_TXD0_SPI2_MOSI_P3) ; port PD13_TXD0_SPI2_MOSI_P3
PD14_CTS1_P2: U1.130(PD14_CTS1_P2) ; port PD14_CTS1_P2
PD15_RTS1_SPI2_SPCK_N4: U1.155(PD15_RTS1_SPI2_SPCK_N4) ; port PD15_RTS1_SPI2_SPCK_N4
PD16_RXD1_R2: U1.127(PD16_RXD1_R2) ; port PD16_RXD1_R2
PD17_TXD1_SPI2_NPCS0_R3: U1.128(PD17_TXD1_SPI2_NPCS0_R3) ; port PD17_TXD1_SPI2_NPCS0_R3
PD19_P11: U1.168(PD19_P11) ; port PD19_P11, port PUSH_BTN_R8
PD21_P10: U1.165(PD21_P10) ; port PD21_P10, port PUSH_BTN_R2
PD22_U11: U1.4(PD22_U11) ; port PD22_U11, port PUSH_BTN_R5
PD23_R10: U1.166(PD23_R10) ; port PD23_R10, port PUSH_BTN_R1
PD24_U10: U1.167(PD24_U10) ; port PD24_U10, port PUSH_BTN_R7
PD25_R11: U1.5(PD25_R11) ; port PD25_R11, port PUSH_BTN_R6
PD26_U13: U1.133(PD26_U13) ; port PD26_U13
PD27_T14: R143.2 U1.160(PD27_T14) ; port PD27_T14
PD28_SCK0_R1: U1.122(PD28_SCK0_R1) ; port PD28_SCK0_R1
PD29_SCK1_P1: U1.121(PD29_SCK1_P1) ; port PD29_SCK1_P1
PD31_SPI0_NPCS2_PCK1_P5: U1.156(PD31_SPI0_NPCS2_PCK1_P5) ; port PD31_SPI0_NPCS2_PCK1_P5, port PUSH_BTN_R3
PE0_MCI0_CDB_CTS4_W19_INT: U1.28(PE0_MCI0_CDB_CTS4_W19) ; port PE0_MCI0_CDB_CTS4_W19_INT
PE1_MCI0_DB0_U17_INT: U1.23(PE1_MCI0_DB0_U17) ; port PE1_MCI0_DB0_U17_INT
PE2_MCI0_DB1_T17_INT: U1.26(PE2_MCI0_DB1_T17) ; port PE2_MCI0_DB1_T17_INT
PE3_MCI0_DB2_P16_INT: U1.12(PE3_MCI0_DB2_P16) ; port PE3_MCI0_DB2_P16_INT
PE4_MCI0_DB3_U18_INT: U1.19(PE4_MCI0_DB3_U18) ; port PE4_MCI0_DB3_U18_INT
PE5_CTS3_R17: U1.20(PE5_CTS3_R17) ; port PE5_CTS3_R17
PE6_TIOA3_V19: U1.30(PE6_TIOA3_V19) ; port PE6_TIOA3_V19
PE7_TIOB3_PWMFI1_U19: U1.31(PE7_TIOB3_PWMFI1_U19) ; port PE7_TIOB3_PWMFI1_U19
PE8_TCLK3_PWML3_T19_INT: U1.24(PE8_TCLK3_PWML3_T19) ; port PE8_TCLK3_PWML3_T19_INT
PE9_TIOA2_T18: U1.32(PE9_TIOA2_T18) ; port PE9_TIOA2_T18
PE10_TIOB2_N14: U1.164(PE10_TIOB2_N14) ; port PE10_TIOB2_N14
PE11_TCLK2_R18: U1.36(PE11_TCLK2_R18) ; port PE11_TCLK2_R18
PE12_TIOA1_PWMH2_P17: U1.27(PE12_TIOA1_PWMH2_P17) ; port PE12_TIOA1_PWMH2_P17
PE13_TIOB1_PWML2_P18: U1.34(PE13_TIOB1_PWML2_P18) ; port PE13_TIOB1_PWML2_P18
PE14_TCLK1_PWMH3_N17: U1.29(PE14_TCLK1_PWMH3_N17) ; port PE14_TCLK1_PWMH3_N17
PE15_SCK3_TIOA0_N18: U1.39(PE15_SCK3_TIOA0_N18) ; port PE15_SCK3_TIOA0_N18
PE16_RXD3_TIOB0_M15: U1.14(PE16_RXD3_TIOB0_M15) ; port PE16_RXD3_TIOB0_M15
PE17_TXD3_TCLK0_N19: U1.38(PE17_TXD3_TCLK0_N19) ; port PE17_TXD3_TCLK0_N19
PE18_TIOA5_MCI1_CK_P19: U1.35(PE18_TIOA5_MCI1_CK_P19) ; port PE18_TIOA5_MCI1_CK_P19
PE19_TIOB5_MCI1_CDA_N16: U1.18(PE19_TIOB5_MCI1_CDA_N16) ; port PE19_TIOB5_MCI1_CDA_N16
PE20_TCLK5_MCI1_DA0_M14: U1.13(PE20_TCLK5_MCI1_DA0_M14) ; port PE20_TCLK5_MCI1_DA0_M14
PE21_TIOA4_MCI1_DA1_M18: U1.41(PE21_TIOA4_MCI1_DA1_M18) ; port PE21_TIOA4_MCI1_DA1_M18
PE22_TIOB4_MCI1_DA2_M19: U1.40(PE22_TIOB4_MCI1_DA2_M19) ; port PE22_TIOB4_MCI1_DA2_M19
PE23_TCLK4_MCI_DA3_L18: U1.43(PE23_TCLK4_MCI_DA3_L18) ; port PE23_TCLK4_MCI_DA3_L18
PE24_RTS3_L19: U1.33(PE24_RTS3_L19) ; port PE24_RTS3_L19
PE25_SCK4_IRQ_M17: U1.37(PE25_SCK4_IRQ_M17) ; port PE25_SCK4_IRQ_M17
PE26_RXD4_L15: U1.15(PE26_RXD4_L15) ; port PE26_RXD4_L15
PE27_TXD4_M16: U1.17(PE27_TXD4_M16) ; port PE27_TXD4_M16
PE28_RTS4_L17: U1.42(PE28_RTS4_L17) ; port PE28_RTS4_L17
PE29_DIBP_URXD0_TWD1_V1: U1.123(PE29_DIBP_URXD0_TWD1_V1) ; port PE29_DIBP_URXD0_TWD1_V1
PE30_DIBN_UTXD0_TWCK1_U2: U1.125(PE30_DIBN_UTXD0_TWCK1_U2) ; port PE30_DIBN_UTXD0_TWCK1_U2
PE31_ADTRG_L4: U1.116(PE31_ADTRG_L4) ; port PE31_ADTRG_L4
PIOBU0_U3: U1.135(PIOBU0_U3) ; port PIOBU0_U3
PIOBU1: U1.154(PIOBU1) ; port PIOBU1
RESET: U1.149(RESET) ; port RESET
ROTARY_LED1: U1.9(PC24_ISI_D5_RK1_PCK1_T16) ; port PC24_ISI_D5_RK1_PCK1_T16, port PUSH_BTN_LED1
rx_n: U1.78(ETH_RXN) ; port ETHRX_N
rx_p: U1.79(ETH_RXP) ; port ETHRX_P
SHDN_T2: U1.124(SHDN_T2) ; port SHDN_T2
tx_n: U1.80(ETH_TXN) ; port ETHTX_N
tx_p: U1.81(ETH_TXP) ; port ETHTX_P
usb1_n: U1.143(HHSDMB_V15) ; port HHSDMB_V15
usb1_p: U1.144(HHSDPB_W15) ; port HHSDPB_W15
usb2_n: U1.146(HHSDMC_V16) ; port HHSDMC_V16
usb2_p: U1.145(HHSDPC_W16) ; port HHSDPC_W16
usb_otg_n: U1.141(HHSDMA_DHSDM_V14) ; port HHSDMA_DHSDM_V14
usb_otg_p: U1.142(HHSDPA_DHSDP_W14) ; port HHSDPA_DHSDP_W14
WKUP_V3: U1.132(WKUP_V3) ; port WKUP_V3

Not connected (* = marked no-connect by the designer): U1 82(NC) 83(NC) 84(NC) 85(NC) 86(NC) 87(NC) 88(NC) 89(NC) 90(NC) 91(NC) 92(NC) 150(ADCREF_EXT)*

### Layout directives
differential pair: rx_n, rx_p, tx_n, tx_p, usb1_n, usb1_p, usb2_n, usb2_p, usb_otg_n, usb_otg_p
net class LCD: (no net found under the mark)

### Library data of the parts
C1 = Cap Pol1: Ceramic X5R 25V; Published: 8-Jun-2000; Revision: July-2002: Re-released for DXP Platform.; Publisher: Altium Limited; Value: 10uF
C2 = Cap: Ceramic X7R 50V; Value: 100pF; Published: 8-Jun-2000; LatestRevisionDate: 17-Jul-2002; LatestRevisionNote: Re-released for DXP Platform.; PackageReference: RAD-0.3; Publisher: Altium Limited; PackageDescription: Radial Cap, Thru-Hole; 2 Leads; 0.3 in Pin Spacing
L1 = Inductor: WE 742792022
R1 = Res1: Resistor; Revision: July-2002: Re-released for DXP Platform.
R143 R145 R147 R149 R151 R152 = Res1: Resistor; Value: 1K; Published: 8-Jun-2000; Revision: July-2002: Re-released for DXP Platform.; Publisher: Altium Limited
U1 = develboard_pinout: Faster Little Linux Module; Symbol version: rev.0; Publish date: 26/10/2015; Family: BLUE

## Sheet display.SchDoc
size A3; Hw_rev: 0; License: GPLv3; Address3: Firenze; Address4: ITALY; Revision: 0; SheetNumber: 1; SheetTotal: 1
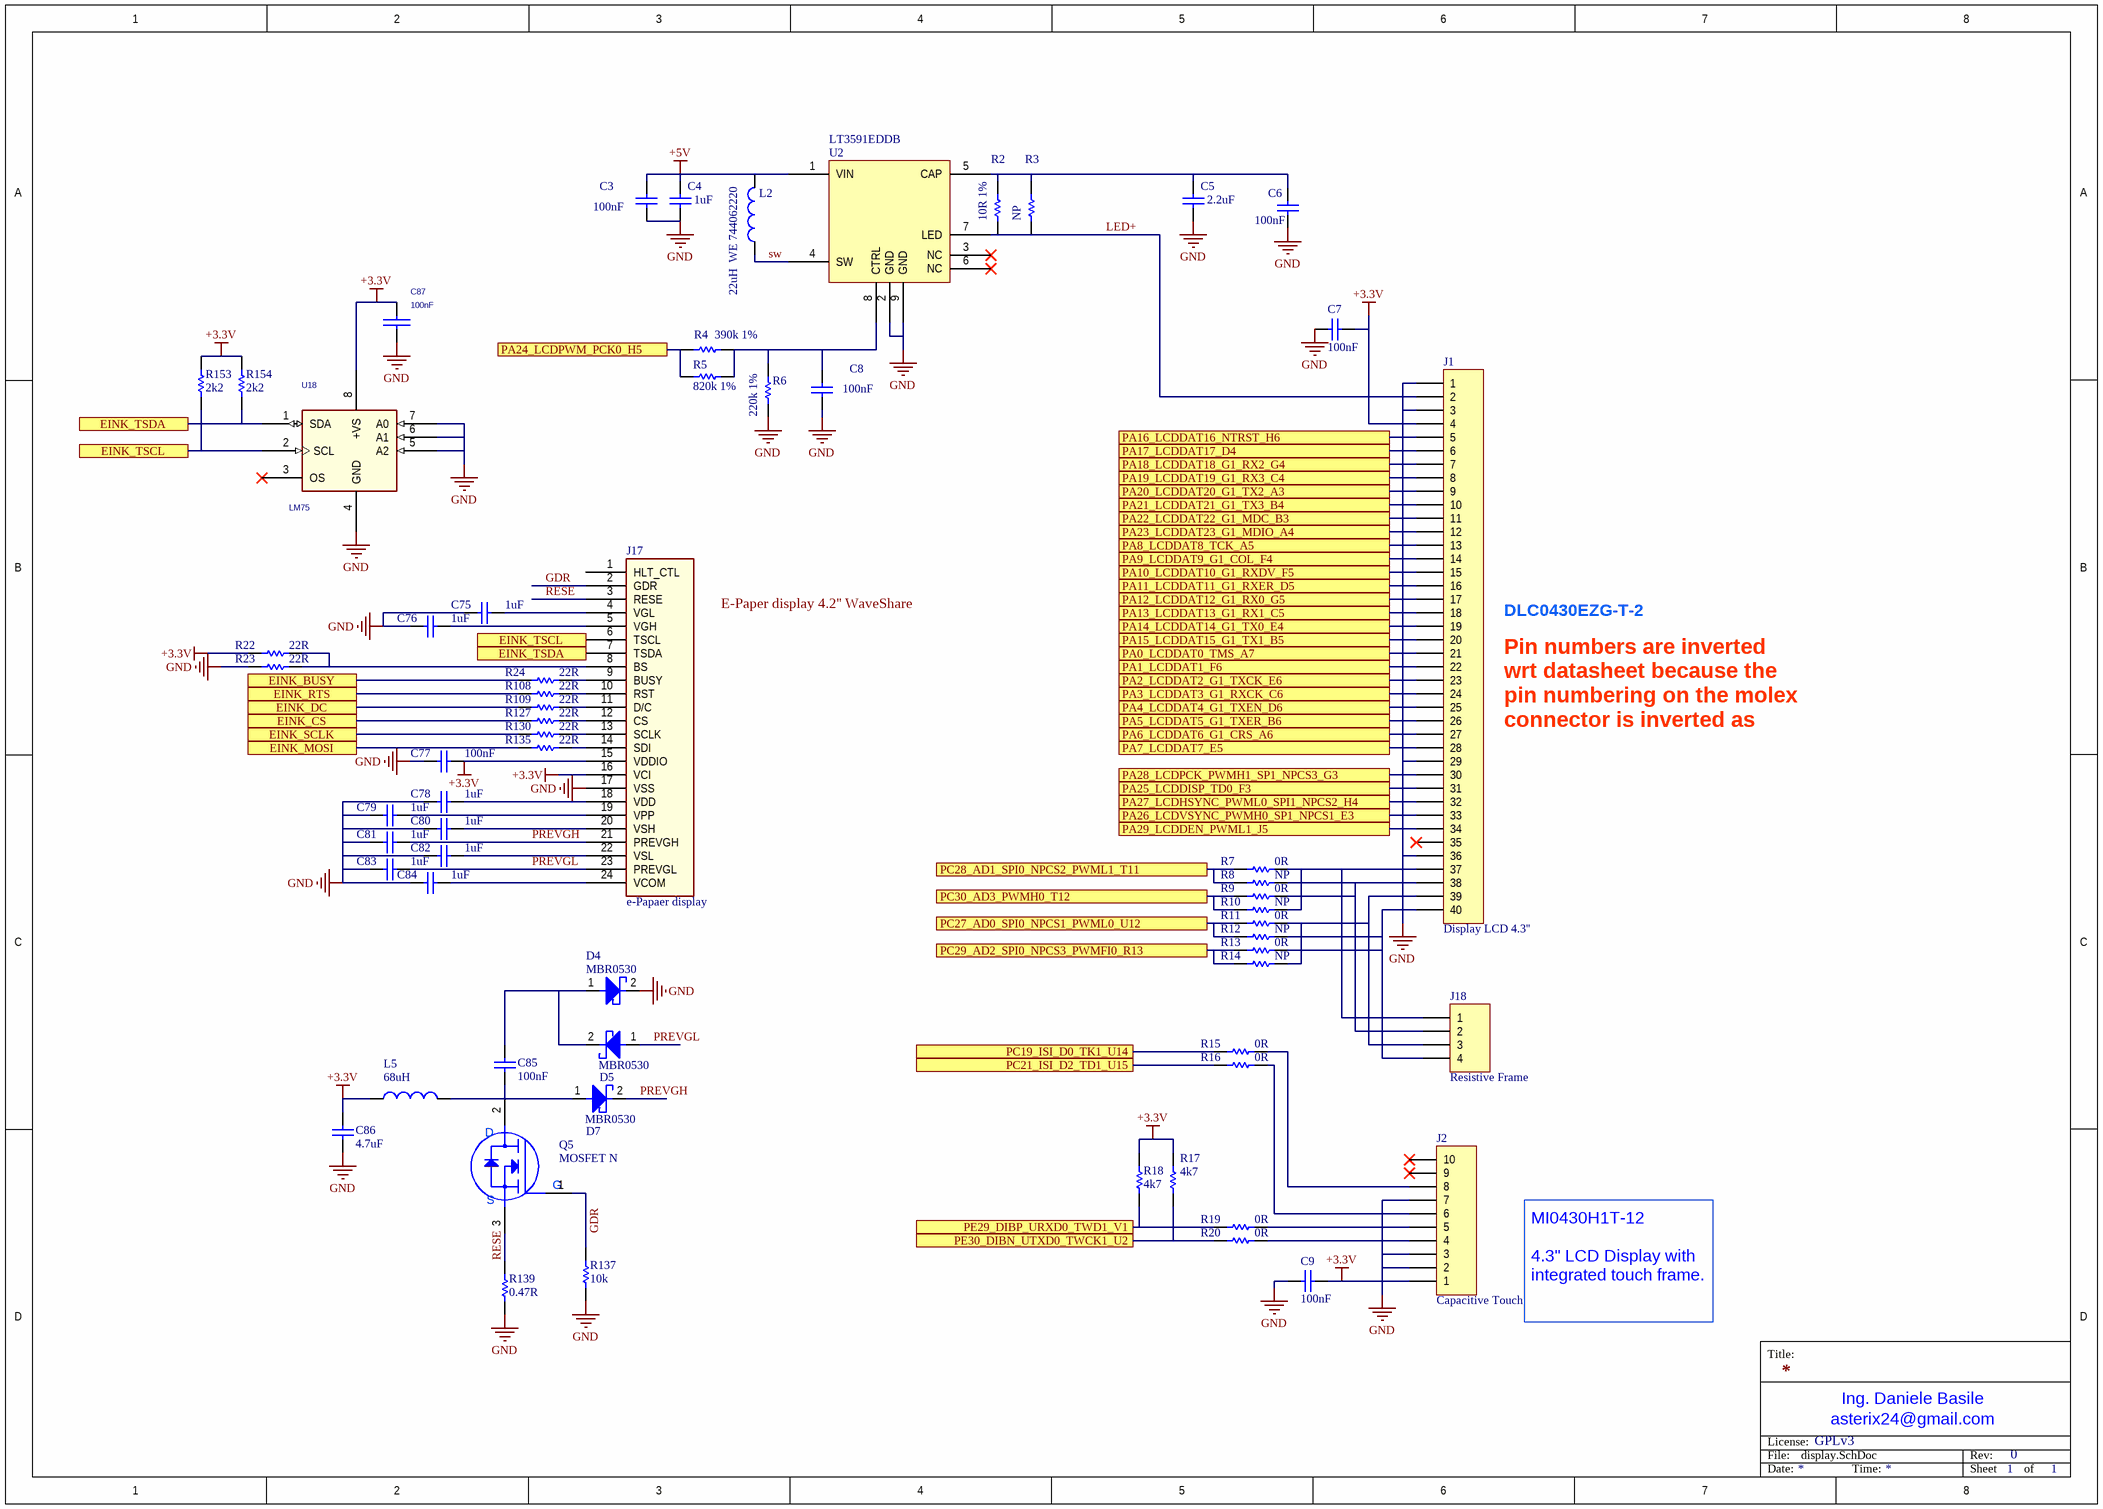
[diagram p2: display.SchDoc]

### Parts
C3  100nF  [0603_[1608]]
C4  1uF  [0805_[2012]]
C5  2.2uF  [1210_[3225]]
C6  100nF  [0603_[1608]]
C7  100nF  [0603_[1608]]
C8  100nF  [0603_[1608]]
C9  100nF  [0603_[1608]]
C75  1uF  [0603_[1608]]
C76  1uF  [0603_[1608]]
C77  100nF  [0603_[1608]]
C78  1uF  [0603_[1608]]
C79  1uF  [0603_[1608]]
C80  1uF  [0603_[1608]]
C81  1uF  [0603_[1608]]
C82  1uF  [0603_[1608]]
C83  1uF  [0603_[1608]]
C84  1uF  [0603_[1608]]
C85  100nF  [0603_[1608]]
C86  4.7uF  [0603_[1608]]
C87  100nF  [0603_[1608]]
D4  MBR0530  [SOD-123_K2-A1]
D5  MBR0530  [SOD-123_K2-A1]
D7  MBR0530  [SOD-123_K2-A1]
J1  Display LCD 4.3''  [fcc-zif_40pin_0.5mm]
J2  Capacitive Touch  [fcc-zif_10pin_0.5mm]
J17  e-Papaer display  [fcc-zif_24pin_0.5mm]
J18  Resistive Frame  [fcc-zif_4pin_1mm]
L2  22uH  WE 744062220  [WE-TPC-6823-X]
L5  68uH  [WE-TPC-6823-X]
Q5  MOSFET N  [sot-23]
R2  10R 1%  [0603_[1608]]
R3  NP  [0603_[1608]]
R4  390k 1%  [0603_[1608]]
R5  820k 1%  [0603_[1608]]
R6  220k 1%  [0603_[1608]]
R7  0R  [0603_[1608]]
R8  NP  [0603_[1608]]
R9  0R  [0603_[1608]]
R10  NP  [0603_[1608]]
R11  0R  [0603_[1608]]
R12  NP  [0603_[1608]]
R13  0R  [0603_[1608]]
R14  NP  [0603_[1608]]
R15  0R  [0603_[1608]]
R16  0R  [0603_[1608]]
R17  4k7  [0603_[1608]]
R18  4k7  [0603_[1608]]
R19  0R  [0603_[1608]]
R20  0R  [0603_[1608]]
R22  22R  [0603_[1608]]
R23  22R  [0603_[1608]]
R24  22R  [0603_[1608]]
R108  22R  [0603_[1608]]
R109  22R  [0603_[1608]]
R127  22R  [0603_[1608]]
R130  22R  [0603_[1608]]
R135  22R  [0603_[1608]]
R137  10k  [0603_[1608]]
R139  0.47R  [0603_[1608]]
R153  2k2  [0603_[1608]]
R154  2k2  [0603_[1608]]
U2  LT3591EDDB  [PQFN50P300X200X75_HS-9L]
U18  LM75  [SOIC8]

### Ports
EINK_BUSY, EINK_CS, EINK_DC, EINK_MOSI, EINK_RTS, EINK_SCLK, EINK_TSCL, EINK_TSDA, PA0_LCDDAT0_TMS_A7, PA1_LCDDAT1_F6, PA2_LCDDAT2_G1_TXCK_E6, PA3_LCDDAT3_G1_RXCK_C6, PA4_LCDDAT4_G1_TXEN_D6, PA5_LCDDAT5_G1_TXER_B6, PA6_LCDDAT6_G1_CRS_A6, PA7_LCDDAT7_E5, PA8_LCDDAT8_TCK_A5, PA9_LCDDAT9_G1_COL_F4, PA10_LCDDAT10_G1_RXDV_F5, PA11_LCDDAT11_G1_RXER_D5, PA12_LCDDAT12_G1_RX0_G5, PA13_LCDDAT13_G1_RX1_C5, PA14_LCDDAT14_G1_TX0_E4, PA15_LCDDAT15_G1_TX1_B5, PA16_LCDDAT16_NTRST_H6, PA17_LCDDAT17_D4, PA18_LCDDAT18_G1_RX2_G4, PA19_LCDDAT19_G1_RX3_C4, PA20_LCDDAT20_G1_TX2_A3, PA21_LCDDAT21_G1_TX3_B4, PA22_LCDDAT22_G1_MDC_B3, PA23_LCDDAT23_G1_MDIO_A4, PA24_LCDPWM_PCK0_H5, PA25_LCDDISP_TD0_F3, PA26_LCDVSYNC_PWMH0_SP1_NPCS1_E3, PA27_LCDHSYNC_PWML0_SPI1_NPCS2_H4, PA28_LCDPCK_PWMH1_SP1_NPCS3_G3, PA29_LCDDEN_PWML1_J5, PC19_ISI_D0_TK1_U14, PC21_ISI_D2_TD1_U15, PC27_AD0_SPI0_NPCS1_PWML0_U12, PC28_AD1_SPI0_NPCS2_PWML1_T11, PC29_AD2_SPI0_NPCS3_PWMFI0_R13, PC30_AD3_PWMH0_T12, PE29_DIBP_URXD0_TWD1_V1, PE30_DIBN_UTXD0_TWCK1_U2

### Nets
+3.3V: C7.1 C9.1 C77.1 C86.1 C87.1 J1.4 J2.1 J17.15(VDDIO) J17.16(VCI) L5.1 R17.1 R18.1 R22.2 R153.1 R154.1 U18.8(+VS)
+5V: C3.2 C4.2 L2.2 U2.1(VIN)
GND: C3.1 C4.1 C5.1 C6.1 C7.2 C8.1 C9.2 C75.2 C76.2 C77.2 C78.2 C79.2 C80.2 C81.2 C82.2 C83.2 C84.2 C86.2 C87.2 D4.2(K) J1.1 J1.3 J1.29 J1.36 J2.2 J2.3 J2.7 J17.17(VSS) R6.2 R23.2 R137.2 R139.2 U2.2(GND) U2.9(GND) U18.4(GND) U18.5(A2) U18.6(A1) U18.7(A0)
CC1310_CS: R127.2 ; port EINK_CS
CC1310_MOSI: R135.2 ; port EINK_MOSI
CC1310_PIN0: R24.2 ; port EINK_BUSY
CC1310_PIN1: R109.2 ; port EINK_DC
CC1310_SCLK: R130.2 ; port EINK_SCLK
EINK_RTS: R108.2 ; port EINK_RTS
EINK_TSCL: J17.6(TSCL) R153.2 U18.2(SCL) ; port EINK_TSCL
EINK_TSDA: J17.7(TSDA) R154.2 U18.1(SDA) ; port EINK_TSDA
GDR: J17.2(GDR) Q5.1(G) R137.1
LED+: J1.2 R2.1 R3.1 U2.7(LED)
PA0_LCDDAT0_TMS_A7: J1.21 ; port PA0_LCDDAT0_TMS_A7
PA1_LCDDAT1_F6: J1.22 ; port PA1_LCDDAT1_F6
PA2_LCDDAT2_G1_TXCK_E6: J1.23 ; port PA2_LCDDAT2_G1_TXCK_E6
PA3_LCDDAT3_G1_RXCK_C6: J1.24 ; port PA3_LCDDAT3_G1_RXCK_C6
PA4_LCDDAT4_G1_TXEN_D6: J1.25 ; port PA4_LCDDAT4_G1_TXEN_D6
PA5_LCDDAT5_G1_TXER_B6: J1.26 ; port PA5_LCDDAT5_G1_TXER_B6
PA6_LCDDAT6_G1_CRS_A6: J1.27 ; port PA6_LCDDAT6_G1_CRS_A6
PA7_LCDDAT7_E5: J1.28 ; port PA7_LCDDAT7_E5
PA8_LCDDAT8_TCK_A5: J1.13 ; port PA8_LCDDAT8_TCK_A5
PA9_LCDDAT9_G1_COL_F4: J1.14 ; port PA9_LCDDAT9_G1_COL_F4
PA10_LCDDAT10_G1_RXDV_F5: J1.15 ; port PA10_LCDDAT10_G1_RXDV_F5
PA11_LCDDAT11_G1_RXER_D5: J1.16 ; port PA11_LCDDAT11_G1_RXER_D5
PA12_LCDDAT12_G1_RX0_G5: J1.17 ; port PA12_LCDDAT12_G1_RX0_G5
PA13_LCDDAT13_G1_RX1_C5: J1.18 ; port PA13_LCDDAT13_G1_RX1_C5
PA14_LCDDAT14_G1_TX0_E4: J1.19 ; port PA14_LCDDAT14_G1_TX0_E4
PA15_LCDDAT15_G1_TX1_B5: J1.20 ; port PA15_LCDDAT15_G1_TX1_B5
PA16_LCDDAT16_NTRST_H6: J1.5 ; port PA16_LCDDAT16_NTRST_H6
PA17_LCDDAT17_D4: J1.6 ; port PA17_LCDDAT17_D4
PA18_LCDDAT18_G1_RX2_G4: J1.7 ; port PA18_LCDDAT18_G1_RX2_G4
PA19_LCDDAT19_G1_RX3_C4: J1.8 ; port PA19_LCDDAT19_G1_RX3_C4
PA20_LCDDAT20_G1_TX2_A3: J1.9 ; port PA20_LCDDAT20_G1_TX2_A3
PA21_LCDDAT21_G1_TX3_B4: J1.10 ; port PA21_LCDDAT21_G1_TX3_B4
PA22_LCDDAT22_G1_MDC_B3: J1.11 ; port PA22_LCDDAT22_G1_MDC_B3
PA23_LCDDAT23_G1_MDIO_A4: J1.12 ; port PA23_LCDDAT23_G1_MDIO_A4
PA24_LCDPWM_PCK0_H5: R4.2 R5.1 ; port PA24_LCDPWM_PCK0_H5
PA25_LCDDISP_TD0_F3: J1.31 ; port PA25_LCDDISP_TD0_F3
PA26_LCDVSYNC_PWMH0_SP1_NPCS1_E3: J1.33 ; port PA26_LCDVSYNC_PWMH0_SP1_NPCS1_E3
PA27_LCDHSYNC_PWML0_SPI1_NPCS2_H4: J1.32 ; port PA27_LCDHSYNC_PWML0_SPI1_NPCS2_H4
PA28_LCDPCK_PWMH1_SP1_NPCS3_G3: J1.30 ; port PA28_LCDPCK_PWMH1_SP1_NPCS3_G3
PA29_LCDDEN_PWML1_J5: J1.34 ; port PA29_LCDDEN_PWML1_J5
PC19_ISI_D0_TK1_U14: R15.2 ; port PC19_ISI_D0_TK1_U14
PC21_ISI_D2_TD1_U15: R16.2 ; port PC21_ISI_D2_TD1_U15
PC27_AD0_SPI0_NPCS1_PWML0_U12: R11.2 R12.2 ; port PC27_AD0_SPI0_NPCS1_PWML0_U12
PC28_AD1_SPI0_NPCS2_PWML1_T11: R7.2 R8.2 ; port PC28_AD1_SPI0_NPCS2_PWML1_T11
PC29_AD2_SPI0_NPCS3_PWMFI0_R13: R13.2 R14.2 ; port PC29_AD2_SPI0_NPCS3_PWMFI0_R13
PC30_AD3_PWMH0_T12: R9.2 R10.2 ; port PC30_AD3_PWMH0_T12
PE29_DIBP_URXD0_TWD1_V1: R18.2 R19.2 ; port PE29_DIBP_URXD0_TWD1_V1
PE30_DIBN_UTXD0_TWCK1_U2: R17.2 R20.2 ; port PE30_DIBN_UTXD0_TWCK1_U2
PREVGH: C81.1 D7.2(K) J17.21(PREVGH)
PREVGL: C83.1 D5.1(A) J17.23(PREVGL)
RESE: J17.3(RESE) Q5.3(S) R139.1
sw: L2.1 U2.4(SW)
NetC5_2: C5.2 C6.2 R2.2 R3.2 U2.5(CAP)
NetC8_2: C8.2 R4.1 R5.2 R6.1 U2.8(CTRL)
NetC75_1: C75.1 J17.4(VGL)
NetC76_1: C76.1 J17.5(VGH)
NetC78_1: C78.1 J17.18(VDD)
NetC79_1: C79.1 J17.19(VPP)
NetC80_1: C80.1 J17.20(VSH)
NetC82_1: C82.1 J17.22(VSL)
NetC84_1: C84.1 J17.24(VCOM)
NetC85_1: C85.1 D4.1(A) D5.2(K)
NetC85_2: C85.2 D7.1(A) L5.2 Q5.2(D)
NetJ1_37: J1.37 J18.1 R7.1 R10.1
NetJ1_38: J1.38 J18.2 R8.1 R9.1
NetJ1_39: J1.39 J18.3 R11.1 R14.1
NetJ1_40: J1.40 J18.4 R12.1 R13.1
NetJ2_4: J2.4 R20.1
NetJ2_5: J2.5 R19.1
NetJ2_6: J2.6 R16.1
NetJ2_8: J2.8 R15.1
NetJ17_8: J17.8(BS) R22.1 R23.1
NetJ17_9: J17.9(BUSY) R24.1
NetJ17_10: J17.10(RST) R108.1
NetJ17_11: J17.11(D/C) R109.1
NetJ17_12: J17.12(CS) R127.1
NetJ17_13: J17.13(SCLK) R130.1
NetJ17_14: J17.14(SDI) R135.1

Not connected (* = marked no-connect by the designer): J1 35*; J2 9* 10*; J17 1(HLT_CTL); U2 3(NC)* 6(NC)*; U18 3(OS)*

### Notes on the sheet
- E-Paper display 4.2'' WaveShare
- DLC0430EZG-T-2
- Pin numbers are inverted wrt datasheet because the pin numbering on the molex connector is inverted as well!
- MI0430H1T-12
  4.3'' LCD Display with integrated touch frame.
- Title:
- File:
- License:
- asterix24@gmail.com
- Ing. Daniele Basile
- Rev:
- Date:
- Time:
- Sheet
- of

### Library data of the parts
C3 C4 C6-C9 C75-C86 = Cap: Ceramic X7R 50V; Value: 10nF; Published: 8-Jun-2000; Revision: July-2002: Re-released for DXP Platform.; Publisher: Altium Limited
C5 = Cap: Ceramic X7R, X5R 50V; Value: 10nF; Published: 8-Jun-2000; Revision: July-2002: Re-released for DXP Platform.; Publisher: Altium Limited
C87 = C: Ceramic X7R 50V
D4 D5 D7 = Diode_SCHOTTKY: Schottky Diodes
J1 = Header 40: 40-pin, 0.5mm, SMT, ZIF, Horizontal, Top Contact (WE 68714014022; Molex: 54104-4031); LatestRevisionDate: 17-Jul-2002; LatestRevisionNote: Re-released for DXP Platform.; Publisher: Altium Limited
J2 = Header 10: 10-pin, 0.5mm, SMT, ZIF, Horizontal, Top Contact; LatestRevisionDate: 17-Jul-2002; LatestRevisionNote: Re-released for DXP Platform.; Publisher: Altium Limited
J17 = e-paper_display_waveshare: e-paper display wave share
J18 = Header 4: Zip FCC connector; LatestRevisionDate: 17-Jul-2002; LatestRevisionNote: Re-released for DXP Platform.; Publisher: Altium Limited
L2 L5 = Inductor: Power Inductor
Q5 = MOSFET-N 3pin: MOSFET Channl N
R2 = Res1: Resistor 0.125W; Value: 1K; Published: 8-Jun-2000; Revision: July-2002: Re-released for DXP Platform.; Publisher: Altium Limited
R3-R20 R22-R24 R108 R109 R127 R130 R135 R137 R139 R153 R154 = Res1: Resistor; Value: 1K; Published: 8-Jun-2000; Revision: July-2002: Re-released for DXP Platform.; Publisher: Altium Limited
U2 = LT3591: White LED Driver with Integrated Schottky
U18 = LM75: IC LM75BIM-3.0

## Sheet supply.SchDoc
size A3; Hw_rev: 0; License: GPLv3; Address3: Firenze; Address4: ITALY; DocumentNumber: 2; Revision: 0; SheetNumber: 2; SheetTotal: 8
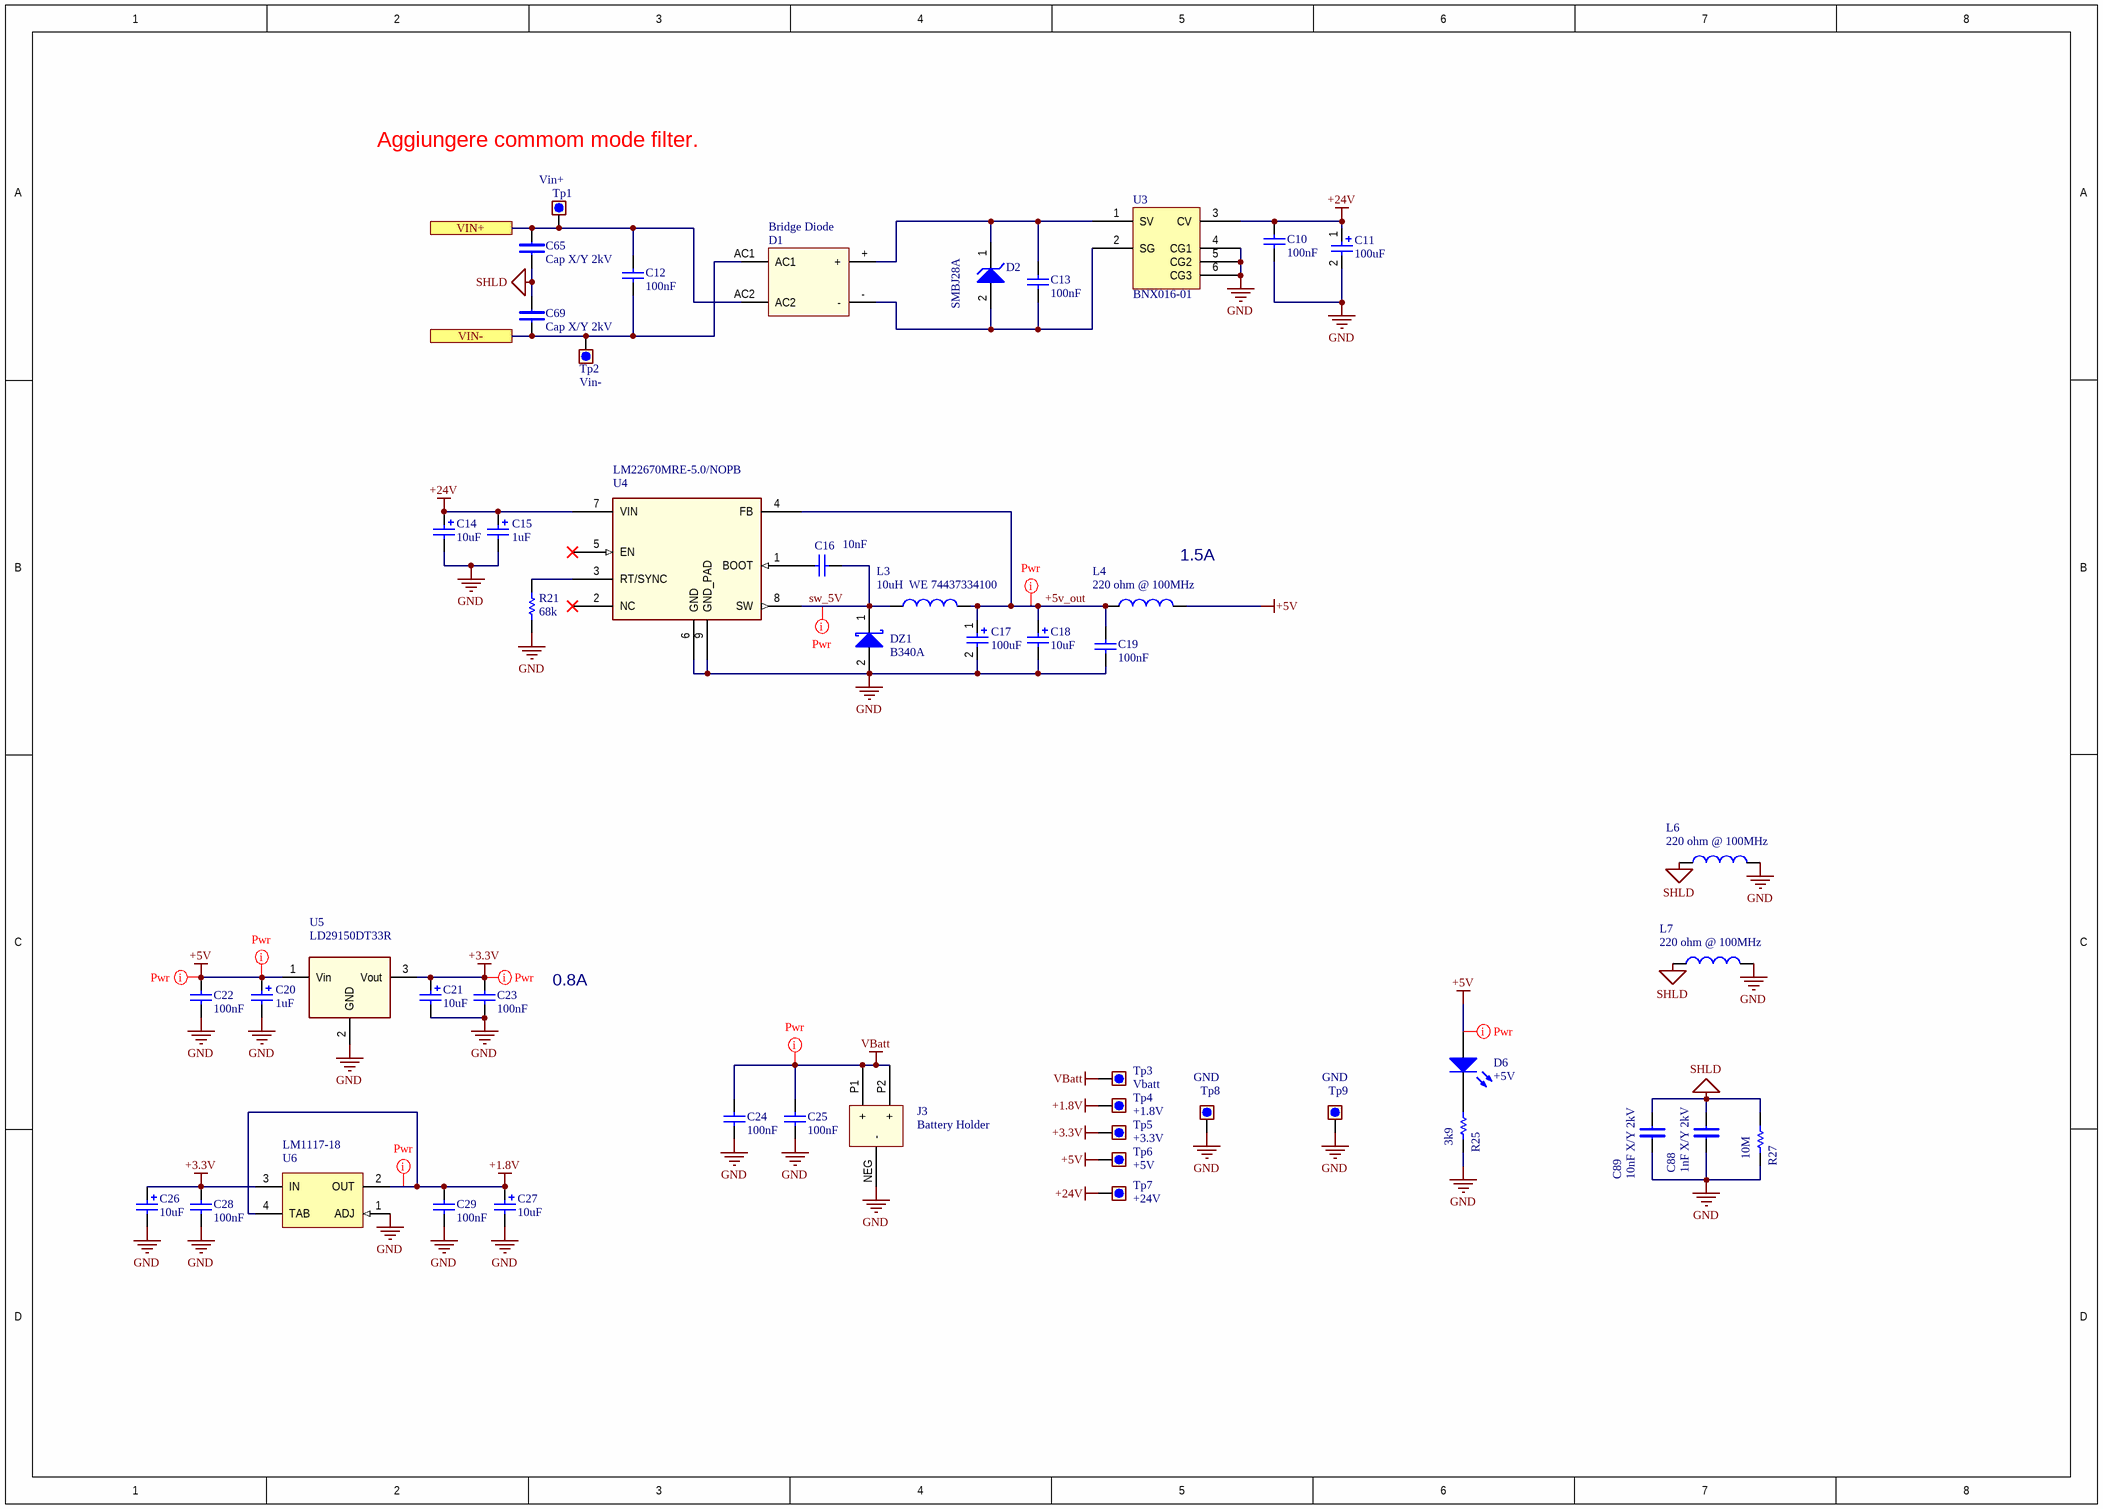
[diagram p3: supply.SchDoc]

### Parts
C10  100nF  [0603_[1608]]
C11  100uF  [CAP_6x6_D8_SMD]
C12  100nF  [0603_[1608]]
C13  100nF  [0603_[1608]]
C14  10uF  [1206_[3216]]
C15  1uF  [0805_[2012]]
C16  10nF  [0603_[1608]]
C17  100uF  [[7343]_CAP_TAN]
C18  10uF  [1206_[3216]]
C19  100nF  [0603_[1608]]
C20  1uF  [0805_[2012]]
C21  10uF  [1206_[3216]]
C22  100nF  [0603_[1608]]
C23  100nF  [0603_[1608]]
C24  100nF  [0603_[1608]]
C25  100nF  [0603_[1608]]
C26  10uF  [1206_[3216]]
C27  10uF  [1206_[3216]]
C28  100nF  [0603_[1608]]
C29  100nF  [0603_[1608]]
C65  Cap X/Y 2kV  [1808_[4520]]
C69  Cap X/Y 2kV  [1808_[4520]]
C88  1nF X/Y 2kV  [1808_[4520]]
C89  10nF X/Y 2kV  [2220_[5650]]
D1  Bridge Diode  [Diode_bridge_smd]
D2  SMBJ28A  [DO214AA_K1-A2_SMB]
D6  +5V  [0603_[1608]_K2-A1_LED]
DZ1  B340A  [DO214AA_K1-A2_SMB]
J3  Battery Holder  [Battery_holder_16mm_thd]
L3  10uH  WE 74437334100  [WE-LHMI_5020]
L4  220 ohm @ 100MHz  [0805_[2012]]
L6  220 ohm @ 100MHz  [0805_[2012]]
L7  220 ohm @ 100MHz  [0805_[2012]]
R21  68k  [0603_[1608]]
R25  3k9  [0603_[1608]]
R27  10M  [1206_[3216]]
Tp1  Vin+  [TEST_POINT_THD_D1.8MM]  (no BOM)
Tp2  Vin-  [TEST_POINT_THD_D1.8MM]  (no BOM)
Tp3  Vbatt  [TEST_POINT_THD_D1.8MM]  (no BOM)
Tp4  +1.8V  [TEST_POINT_THD_D1.8MM]  (no BOM)
Tp5  +3.3V  [TEST_POINT_THD_D1.8MM]  (no BOM)
Tp6  +5V  [TEST_POINT_THD_D1.8MM]  (no BOM)
Tp7  +24V  [TEST_POINT_THD_D1.8MM]  (no BOM)
Tp8  GND  [TEST_POINT_THD_D1.8MM]  (no BOM)
Tp9  GND  [TEST_POINT_THD_D1.8MM]  (no BOM)
U3  BNX016-01  [BNX001]
U4  LM22670MRE-5.0/NOPB  [SOIC8_PAD]
U5  LD29150DT33R  [TO-252_D2PAK_LARGEPAD]
U6  LM1117-18  [SOT-223]

### Ports
VIN+, VIN-

### Nets
+1.8V: C27.1 C29.2 Tp4.1 U6.2(OUT) U6.4(TAB)
+3.3V: C21.1 C23.2 C26.1 C28.2 Tp5.1 U5.3(Vout) U6.3(IN)
+5V: C20.1 C22.2 D6.1(A) L4.1 Tp6.1 U5.1(Vin)
+24V: C10.2 C11.1 C14.1 C15.1 Tp7.1 U3.3(CV) U4.7(VIN)
GND: C10.1 C11.2 C14.2 C15.2 C17.2 C18.2 C19.1 C20.2 C21.2 C22.1 C23.1 C24.1 C25.1 C26.2 C27.2 C28.1 C29.1 C88.2 C89.2 DZ1.2(A) J3.NEG(-) L6.1 L7.1 R21.1 R25.1 R27.1 Tp8.1 Tp9.1 U3.4(CG1) U3.5(CG2) U3.6(CG3) U4.6(GND) U4.9(GND_PAD) U5.2(GND) U6.1(ADJ)
SHLD: C65.2 C69.1 C88.1 C89.1 L6.2 L7.2 R27.2
VBatt: C24.2 C25.2 J3.P1(+) J3.P2(+) Tp3.1
+5v_out: C17.1 C18.1 C19.2 L3.2 L4.2 U4.4(FB)
sw_5V: C16.2 DZ1.1(K) L3.1 U4.8(SW)
VIN+: C12.2 C65.1 D1.AC2 Tp1.1 ; port VIN+
VIN-: C12.1 C69.2 D1.AC1 Tp2.1 ; port VIN-
NetC13_1: C13.1 D1.- D2.2(A) U3.2(SG)
NetC13_2: C13.2 D1.+ D2.1(K) U3.1(SV)
NetC16_1: C16.1 U4.1(BOOT)
NetD6_2: D6.2(K) R25.2
NetR21_2: R21.2 U4.3(RT/SYNC)

Not connected (* = marked no-connect by the designer): U4 2(NC)* 5(EN)*

### Layout directives
net class Power: +1.8V, +3.3V, +5V, +5v_out, sw_5V, VBatt

### Notes on the sheet
- Aggiungere commom mode filter.
- (near L4) 1.5A
- 0.8A

### Library data of the parts
C10 C12 C13 C16 C19 C22-C25 C28 C29 = Cap: Ceramic X7R 50V; Value: 100pF; Published: 8-Jun-2000; LatestRevisionDate: 17-Jul-2002; LatestRevisionNote: Re-released for DXP Platform.; PackageReference: RAD-0.3; Publisher: Altium Limited; PackageDescription: Radial Cap, Thru-Hole; 2 Leads; 0.3 in Pin Spacing
C11 = Cap Pol1: EEEFK1H101P SMT 6x6 35V; Value: 10uF; Published: 8-Jun-2000; Revision: July-2002: Re-released for DXP Platform.; Publisher: Altium Limited
C14 C18 C21 C26 C27 = Cap Pol1: Ceramic X5R 25V; Published: 8-Jun-2000; Revision: July-2002: Re-released for DXP Platform.; Publisher: Altium Limited; Value: 10uF
C15 C20 = Cap Pol1: Ceramic X7R 50V; Value: 10uF; Published: 8-Jun-2000; Revision: July-2002: Re-released for DXP Platform.; Publisher: Altium Limited
C17 = Cap Pol1: Tantalum 10V (T495D107K010ATE100); Value: 10uF; Published: 8-Jun-2000; Revision: July-2002: Re-released for DXP Platform.; Publisher: Altium Limited
C65 C69 = cap_xy: Ceramic 1nF 1808 250VAC X7R X1/Y1 (Murata GA342DR7GF102KW)
C88 = cap_xy: Ceramic 250VAC X7R X1/Y1 (GA342DR7GF102KW)
C89 = cap_xy: Ceramic 250VAC X7R X1/Y1 (GA355DR7GB103KY02L)
D1 = Diode_bridge2: MBS4 (Farnell cod:4084985)
D2 = D Zener: TVS Monodirectional; Published: 8-Jun-2000; LatestRevisionDate: 17-Jul-2002; LatestRevisionNote: Re-released for DXP Platform.; PackageReference: DIODE-0.7; Publisher: Altium Limited; PackageDescription: Diode, Thru-Hole; 2 Leads; 0.7 in Pin Spacing
D6 = LED0: LED Green; Published: 8-Jun-2000; LatestRevisionDate: 08-Jul-2005; LatestRevisionNote: Mech Layer 1 removed.; PackageReference: LED-0; Publisher: Altium Limited; PackageDescription: LED; 2 Leads
DZ1 = D Schottky: Diode Schottky (STPS2L40U); Published: 8-Jun-2000; LatestRevisionDate: 17-Jul-2002; LatestRevisionNote: Re-released for DXP Platform.; PackageReference: SMB; Publisher: Altium Limited; PackageDescription: DO-214-AA/SMB; 2 C-Bend Leads; Body 5.3 x 3.6 mm, inc. leads (LxW); Code_JEDEC: DO-214-AA
J3 = Battery_holder_3002: CR1612/1616/1620/1632 (3013, Keystone)
L3 = Inductor: SMD Shielded Tiny Power Inductor; Code_IEC: 1005; Value: 10mH; Published: 8-Jun-2000; LatestRevisionDate: 29-May-2009; LatestRevisionNote: IPC-7351 Footprint Added.; PackageReference: 0402-A; Publisher: Altium Limited; PackageDescription: Chip Inductor; Code_JEITA: 0402
L4 L6 L7 = Inductor: WE 742792022
R21 R25 R27 = Res1: Resistor; Revision: July-2002: Re-released for DXP Platform.
Tp1-Tp9 = Test_point: Test point
U3 = BNX002: EMI Filter DC power line
U4 = LM22670MR-ADJ: Power switch
U5 = LD29150DT33R: Very Low Drop Linear regulator 3.3V (BA33BC0FP-E2; MIC2940A-3.3WU)
U6 = LM317AEMP: LDO, Fixed Vout = 1.8V; Manufacturer: National Semiconductor; PackageTopMarking: XYTT*N07A; PowerWise: N; CompType: LDO IC; Published: 4-Dec-2008; DatasheetVersion: Apr-2007; PackageVersion: revB, Apr-2003; PackageReference: MP04A; Publisher: Altium Limited; PackageDescription: Molded SOT-223, 6.50 x 3.56 x 1.6mm Body, 4 Lead, 2.3mm Pitch; Supplier 1: Farnell; Supplier Part Number 1: 9779272RL; Supplier 2: Farnell; Supplier Part Number 2: 9779272; PartNumber: LM317AEMP; RoHS: N; PinCount: 4; Code_JEDEC: TO-261-AA; Code_IPC: SOT223-4; ComponentLink1Description: LM317 Datasheet; ComponentLink1URL: http://www.national.com/ds/LM/LM317.pdf; ComponentLink2Description: LM317 Web Page; ComponentLink2URL: http://www.national.com/pf/LM/LM317.html; ComponentLink3Description: MP04A Package Page; ComponentLink3URL: http://www.national.com/packaging/folders/mp04a.html

## Sheet sensor_output.SchDoc: Sensor and outputs.
size A3; Hw_rev: 0; License: GPLv3; Address3: Firenze; Address4: ITALY; DocumentNumber: 5; Revision: 0; SheetNumber: 5; SheetTotal: 8
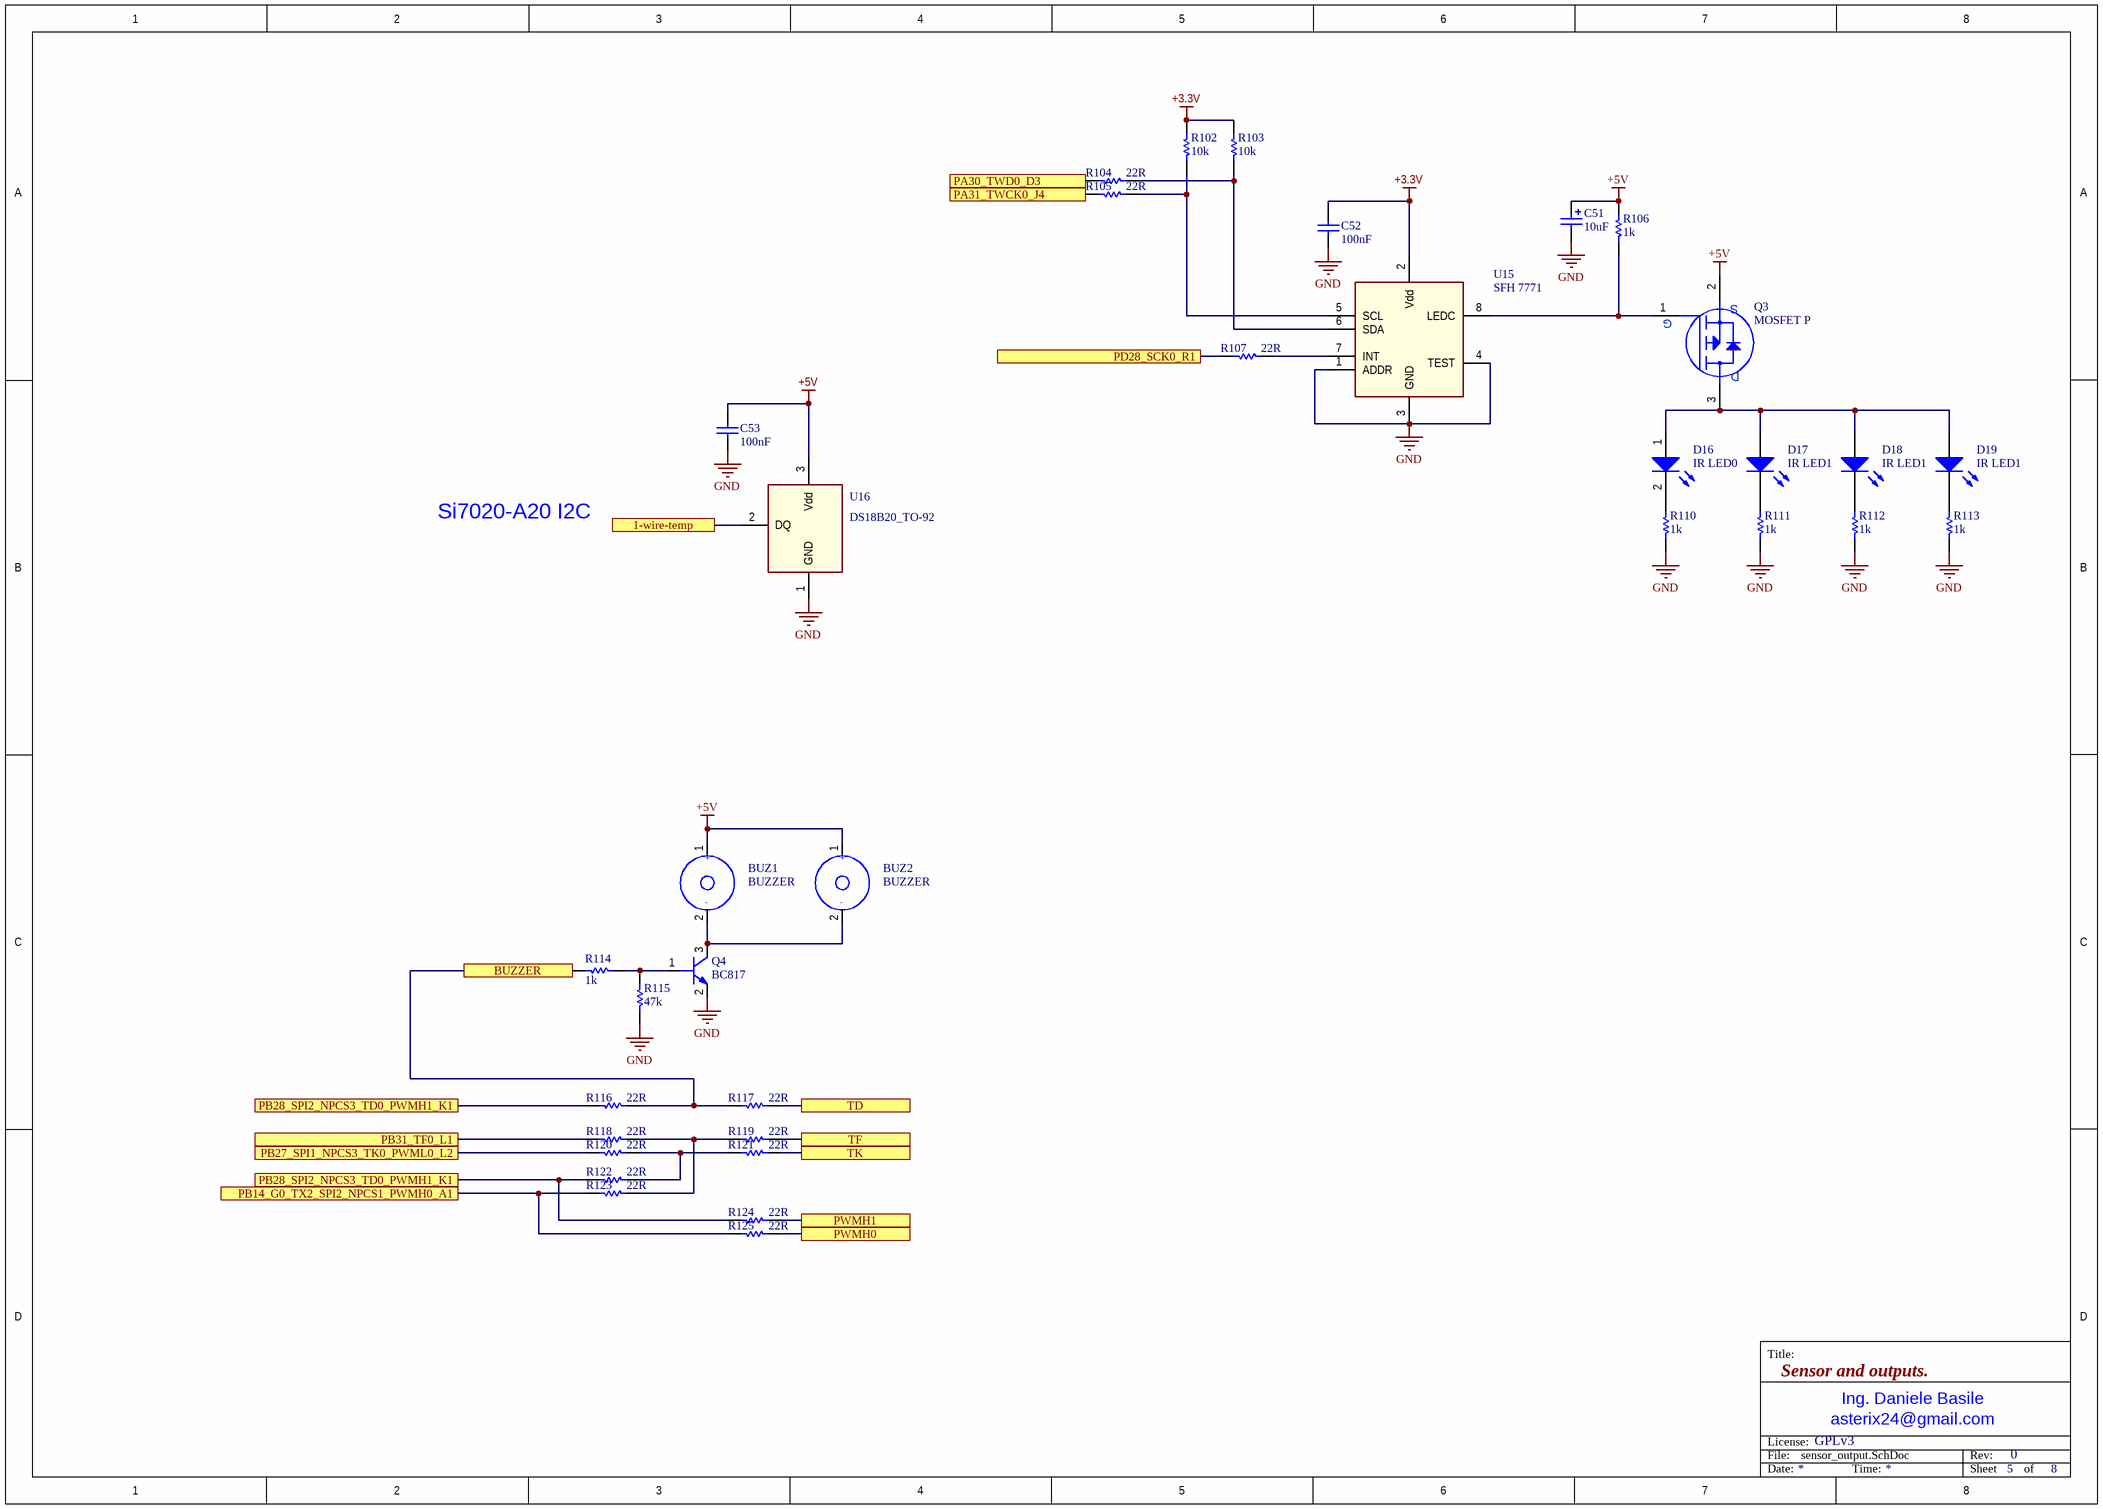
[diagram p4: sensor_output.SchDoc]

### Parts
BUZ1  BUZZER  [buzzer_14mm_thd]
BUZ2  BUZZER  [BUZZER_9x9MM_SMD]
C51  10uF  [1206_[3216]]
C52  100nF  [0603_[1608]]
C53  100nF  [0603_[1608]]
D16  IR LED0  [0603_[1608]_K2-A1_LED]
D17  IR LED1  [0603_[1608]_K2-A1_LED]
D18  IR LED1  [0603_[1608]_K2-A1_LED]
D19  IR LED1  [0603_[1608]_K2-A1_LED]
Q3  MOSFET P  [SOT-23]
Q4  BC817  [SOT-23]
R102  10k  [0603_[1608]]
R103  10k  [0603_[1608]]
R104  22R  [0603_[1608]]
R105  22R  [0603_[1608]]
R106  1k  [0603_[1608]]
R107  22R  [0603_[1608]]
R110  1k  [0603_[1608]]
R111  1k  [0603_[1608]]
R112  1k  [0603_[1608]]
R113  1k  [0603_[1608]]
R114  1k  [0603_[1608]]
R115  47k  [0603_[1608]]
R116  22R  [0603_[1608]]
R117  22R  [0603_[1608]]
R118  22R  [0603_[1608]]
R119  22R  [0603_[1608]]
R120  22R  [0603_[1608]]
R121  22R  [0603_[1608]]
R122  22R  [0603_[1608]]
R123  22R  [0603_[1608]]
R124  22R  [0603_[1608]]
R125  22R  [0603_[1608]]
U15  SFH 7771  [QFN_SFH7771]
U16  DS18B20_TO-92  [TO-92]

### Ports
1-wire-temp, BUZZER, PA30_TWD0_D3, PA31_TWCK0_J4, PB14_G0_TX2_SPI2_NPCS1_PWMH0_A1, PB27_SPI1_NPCS3_TK0_PWML0_L2, PB28_SPI2_NPCS3_TD0_PWMH1_K1, PB31_TF0_L1, PD28_SCK0_R1, PWMH0, PWMH1, TD, TF, TK

### Nets
+3.3V: C52.2 R102.1 R103.1 U15.2(Vdd)
+5V: BUZ1.1 BUZ2.1 C51.1 C53.2 Q3.2(S) R106.1 U16.3(Vdd)
GND: C51.2 C52.1 C53.1 Q4.2(E) R110.2 R111.2 R112.2 R113.2 R115.2 U15.1(ADDR) U15.3(GND) U15.4(TEST) U16.1(GND)
1-wire-temp: U16.2(DQ) ; port 1-wire-temp
BUZZER: R114.2 R116.1 R117.2 ; port BUZZER
PA30_TWD0_D3: R104.2 ; port PA30_TWD0_D3
PA31_TWCK0_J4: R105.2 ; port PA31_TWCK0_J4
PB14_G0_TX2_SPI2_NPCS1_PWMH0_A1: R123.2 R125.2 ; port PB14_G0_TX2_SPI2_NPCS1_PWMH0_A1
PB27_SPI1_NPCS3_TK0_PWML0_L2: R120.2 ; port PB27_SPI1_NPCS3_TK0_PWML0_L2
PB28_SPI2_NPCS3_TD0_PWMH1_K1: R116.2 R122.2 R124.2 ; port PB28_SPI2_NPCS3_TD0_PWMH1_K1
PB31_TF0_L1: R118.2 ; port PB31_TF0_L1
PD28_SCK0_R1: R107.2 ; port PD28_SCK0_R1
PWMH0: R125.1 ; port PWMH0
PWMH1: R124.1 ; port PWMH1
TD: R117.1 ; port TD
TF: R119.1 ; port TF
TK: R121.1 ; port TK
NetBUZ1_2: BUZ1.2 BUZ2.2 Q4.3(C)
NetD16_1: D16.1(A) D17.1(A) D18.1(A) D19.1(A) Q3.3(D)
NetD16_2: D16.2(K) R110.1
NetD17_2: D17.2(K) R111.1
NetD18_2: D18.2(K) R112.1
NetD19_2: D19.2(K) R113.1
NetQ3_1: Q3.1(G) R106.2 U15.8(LEDC)
NetQ4_1: Q4.1(B) R114.1 R115.1
NetR102_2: R102.2 R105.1 U15.5(SCL)
NetR103_2: R103.2 R104.1 U15.6(SDA)
NetR107_1: R107.1 U15.7(INT)
NetR118_1: R118.1 R119.2 R123.1
NetR120_1: R120.1 R121.2 R122.1

### Notes on the sheet
- Si7020-A20 I2C
- Title:
- File:
- License:
- asterix24@gmail.com
- Ing. Daniele Basile
- Rev:
- Date:
- Time:
- Sheet
- of
- (in symbol BUZZER) +; -

### Library data of the parts
C51 = Cap Pol1: Ceramic X5R 25V; Published: 8-Jun-2000; Revision: July-2002: Re-released for DXP Platform.; Publisher: Altium Limited; Value: 10uF
C52 C53 = Cap: Ceramic X7R 50V; Value: 100pF; Published: 8-Jun-2000; LatestRevisionDate: 17-Jul-2002; LatestRevisionNote: Re-released for DXP Platform.; PackageReference: RAD-0.3; Publisher: Altium Limited; PackageDescription: Radial Cap, Thru-Hole; 2 Leads; 0.3 in Pin Spacing
D16-D19 = LED0: LED Green; Published: 8-Jun-2000; LatestRevisionDate: 08-Jul-2005; LatestRevisionNote: Mech Layer 1 removed.; PackageReference: LED-0; Publisher: Altium Limited; PackageDescription: LED; 2 Leads
Q3 = MOSFET-P 3pin: MOSFET channel P
Q4 = BC817: BJT NPN
R102-R107 R110-R114 R116-R125 = Res1: Resistor; Revision: July-2002: Re-released for DXP Platform.
  R114: Published: 8-Jun-2000; Publisher: Altium Limited; Value: 1K
R115 = Res1: Resistor; Value: 1K; Published: 8-Jun-2000; Revision: July-2002: Re-released for DXP Platform.; Publisher: Altium Limited
U15 = SFH 7771: OSRAM Integrated Ambient Light and Proximity Sensors
U16 = DS18B20_TO-92: 1-Wire temperature sensor.